# Altium project Mercury_AD_BaseBoard.PrjPcb (part 1 of 4)
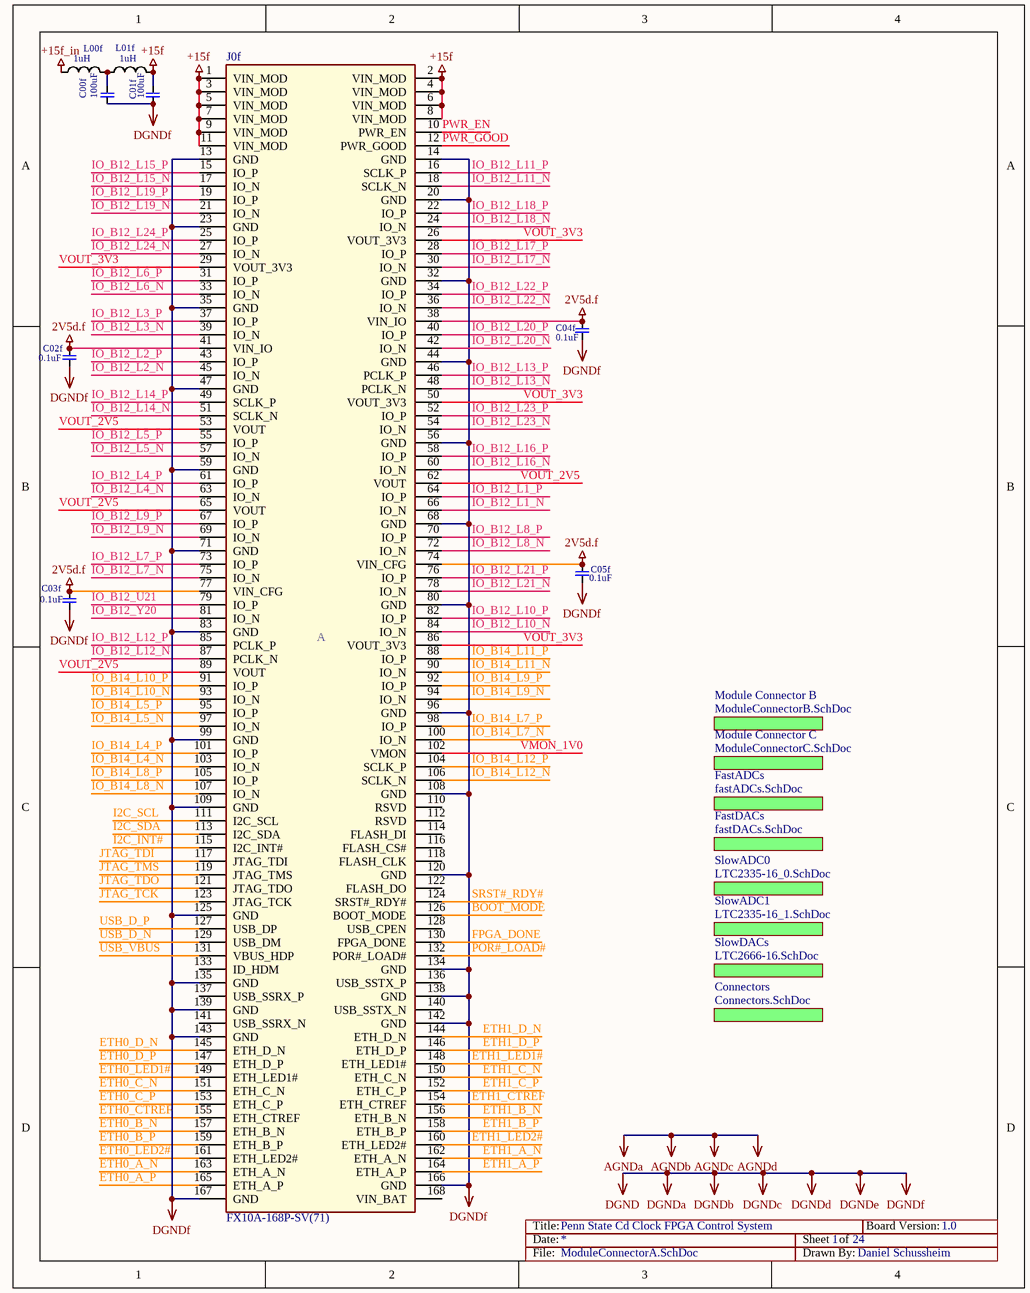
[diagram p0: ModuleConnectorA.SchDoc]
Designer: Daniel Schussheim; DrawnBy: Daniel Schussheim; PrjName: Penn State Cd Clock FPGA Control System; RevNum: 1.0
24 sheets, 1724 parts. Net scope: global (net labels, ports and power ports of the same name join across sheets).
Board file: Mercury_AD_BaseBoard_PCB.PcbDoc
Sheets:
  ModuleConnectorA.SchDoc
    FastDACs = fastDACs.SchDoc
      U_MAX5875_0 = MAX5875_0.SchDoc
      U_MAX5875_1 = MAX5875_1.SchDoc
      U_MAX5875_2 = MAX5875_2.SchDoc
      U_MAX5875_3 = MAX5875_3.SchDoc
      U_MAX5875_4 = MAX5875_4.SchDoc
      U_MAX5875_5 = MAX5875_5.SchDoc
      U_MAX5875_6 = MAX5875_6.SchDoc
    SlowDACs = LTC2666-16.SchDoc
      sDAC0 filters = sDAC_filters_0.SchDoc
      sDAC1 filters = sDAC_filters_1.SchDoc
    SlowADC0 = LTC2335-16_0.SchDoc
    SlowADC1 = LTC2335-16_1.SchDoc
    Connectors = Connectors.SchDoc
      Serial IO = SerialLineShiftRegs.SchDoc
    Module Connector C = ModuleConnectorC.SchDoc
    FastADCs = fastADCs.SchDoc
      FastADC0 = LTC2194_0.SchDoc
      FastADC1 = LTC2194_1.SchDoc
      FastADC2 = LTC2194_2.SchDoc
      FastADC3 = LTC2194_3.SchDoc
      FastADC4 = LTC2194_4.SchDoc
    Module Connector B = ModuleConnectorB.SchDoc

## Sheet ModuleConnectorA.SchDoc
size A portrait; DocumentNumber: 1; SheetNumber: 1; SheetTotal: 24

### Parts
C00f  100uF  [1206]
C01f  100uF  [1206]
C02f  0.1uF  [0603]
C03f  0.1uF  [0603]
C04f  0.1uF  [0603]
C05f  0.1uF  [0603]
J0f  FX10A-168P-SV(71)  [Mercury_Baseboard_Connector]
L00f  1uH  [1206]
L01f  1uH  [1206]

### Sub-sheets
Connectors = Connectors.SchDoc: no entries
FastADCs = fastADCs.SchDoc: no entries
FastDACs = fastDACs.SchDoc: no entries
Module Connector B = ModuleConnectorB.SchDoc: no entries
Module Connector C = ModuleConnectorC.SchDoc: no entries
SlowADC0 = LTC2335-16_0.SchDoc: no entries
SlowADC1 = LTC2335-16_1.SchDoc: no entries
SlowDACs = LTC2666-16.SchDoc: no entries

### Nets
2V5d.f: C02f.1 C03f.1 C04f.1 C05f.1 J0f.38(VIN_IO) J0f.41(VIN_IO) J0f.74(VIN_CFG) J0f.77(VIN_CFG)
+15f: C01f.1 J0f.1(VIN_MOD) J0f.2(VIN_MOD) J0f.3(VIN_MOD) J0f.4(VIN_MOD) J0f.5(VIN_MOD) J0f.6(VIN_MOD) J0f.7(VIN_MOD) J0f.8(VIN_MOD) J0f.9(VIN_MOD) J0f.11(VIN_MOD) L01f.2
+15f_in: L00f.1
AGNDa: C00f.2 C01f.2 C02f.2 C03f.2 C04f.2 C05f.2 J0f.13(GND) J0f.14(GND) J0f.20(GND) J0f.23(GND) J0f.32(GND) J0f.35(GND) J0f.44(GND) J0f.47(GND) J0f.56(GND) J0f.59(GND) J0f.68(GND) J0f.71(GND) J0f.80(GND) J0f.83(GND) J0f.96(GND) J0f.99(GND) J0f.108(GND) J0f.109(GND) J0f.120(GND) J0f.125(GND) J0f.134(GND) J0f.135(GND) J0f.138(GND) J0f.139(GND) J0f.142(GND) J0f.143(GND) J0f.166(GND) J0f.167(GND)  [also labelled AGNDb, AGNDc, AGNDd, DGND, DGNDa, DGNDb, DGNDc, DGNDd, DGNDe, DGNDf]
BOOT_MODE: J0f.126(BOOT_MODE)
ETH0_A_N: J0f.163(ETH_A_N)
ETH0_A_P: J0f.165(ETH_A_P)
ETH0_B_N: J0f.157(ETH_B_N)
ETH0_B_P: J0f.159(ETH_B_P)
ETH0_C_N: J0f.151(ETH_C_N)
ETH0_C_P: J0f.153(ETH_C_P)
ETH0_CTREF: J0f.155(ETH_CTREF)
ETH0_D_N: J0f.145(ETH_D_N)
ETH0_D_P: J0f.147(ETH_D_P)
ETH0_LED1#: J0f.149(ETH_LED1#)
ETH0_LED2#: J0f.161(ETH_LED2#)
ETH1_A_N: J0f.162(ETH_A_N)
ETH1_A_P: J0f.164(ETH_A_P)
ETH1_B_N: J0f.156(ETH_B_N)
ETH1_B_P: J0f.158(ETH_B_P)
ETH1_C_N: J0f.150(ETH_C_N)
ETH1_C_P: J0f.152(ETH_C_P)
ETH1_CTREF: J0f.154(ETH_CTREF)
ETH1_D_N: J0f.144(ETH_D_N)
ETH1_D_P: J0f.146(ETH_D_P)
ETH1_LED1#: J0f.148(ETH_LED1#)
ETH1_LED2#: J0f.160(ETH_LED2#)
FPGA_DONE: J0f.130(FPGA_DONE)
I2C_INT#: J0f.115(I2C_INT#)
I2C_SCL: J0f.111(I2C_SCL)
I2C_SDA: J0f.113(I2C_SDA)
IO_B12_L1_N: J0f.66(IO_N)
IO_B12_L1_P: J0f.64(IO_P)
IO_B12_L2_N: J0f.45(IO_N)
IO_B12_L2_P: J0f.43(IO_P)
IO_B12_L3_N: J0f.39(IO_N)
IO_B12_L3_P: J0f.37(IO_P)
IO_B12_L4_N: J0f.63(IO_N)
IO_B12_L4_P: J0f.61(IO_P)
IO_B12_L5_N: J0f.57(IO_N)
IO_B12_L5_P: J0f.55(IO_P)
IO_B12_L6_N: J0f.33(IO_N)
IO_B12_L6_P: J0f.31(IO_P)
IO_B12_L7_N: J0f.75(IO_N)
IO_B12_L7_P: J0f.73(IO_P)
IO_B12_L8_N: J0f.72(IO_N)
IO_B12_L8_P: J0f.70(IO_P)
IO_B12_L9_N: J0f.69(IO_N)
IO_B12_L9_P: J0f.67(IO_P)
IO_B12_L10_N: J0f.84(IO_N)
IO_B12_L10_P: J0f.82(IO_P)
IO_B12_L11_N: J0f.18(SCLK_N)
IO_B12_L11_P: J0f.16(SCLK_P)
IO_B12_L12_N: J0f.87(PCLK_N)
IO_B12_L12_P: J0f.85(PCLK_P)
IO_B12_L13_N: J0f.48(PCLK_N)
IO_B12_L13_P: J0f.46(PCLK_P)
IO_B12_L14_N: J0f.51(SCLK_N)
IO_B12_L14_P: J0f.49(SCLK_P)
IO_B12_L15_N: J0f.17(IO_N)
IO_B12_L15_P: J0f.15(IO_P)
IO_B12_L16_N: J0f.60(IO_N)
IO_B12_L16_P: J0f.58(IO_P)
IO_B12_L17_N: J0f.30(IO_N)
IO_B12_L17_P: J0f.28(IO_P)
IO_B12_L18_N: J0f.24(IO_N)
IO_B12_L18_P: J0f.22(IO_P)
IO_B12_L19_N: J0f.21(IO_N)
IO_B12_L19_P: J0f.19(IO_P)
IO_B12_L20_N: J0f.42(IO_N)
IO_B12_L20_P: J0f.40(IO_P)
IO_B12_L21_N: J0f.78(IO_N)
IO_B12_L21_P: J0f.76(IO_P)
IO_B12_L22_N: J0f.36(IO_N)
IO_B12_L22_P: J0f.34(IO_P)
IO_B12_L23_N: J0f.54(IO_N)
IO_B12_L23_P: J0f.52(IO_P)
IO_B12_L24_N: J0f.27(IO_N)
IO_B12_L24_P: J0f.25(IO_P)
IO_B12_U21: J0f.79(IO_P)
IO_B12_Y20: J0f.81(IO_N)
IO_B14_L4_N: J0f.103(IO_N)
IO_B14_L4_P: J0f.101(IO_P)
IO_B14_L5_N: J0f.97(IO_N)
IO_B14_L5_P: J0f.95(IO_P)
IO_B14_L7_N: J0f.100(IO_N)
IO_B14_L7_P: J0f.98(IO_P)
IO_B14_L8_N: J0f.107(IO_N)
IO_B14_L8_P: J0f.105(IO_P)
IO_B14_L9_N: J0f.94(IO_N)
IO_B14_L9_P: J0f.92(IO_P)
IO_B14_L10_N: J0f.93(IO_N)
IO_B14_L10_P: J0f.91(IO_P)
IO_B14_L11_N: J0f.90(IO_N)
IO_B14_L11_P: J0f.88(IO_P)
IO_B14_L12_N: J0f.106(SCLK_N)
IO_B14_L12_P: J0f.104(SCLK_P)
JTAG_TCK: J0f.123(JTAG_TCK)
JTAG_TDI: J0f.117(JTAG_TDI)
JTAG_TDO: J0f.121(JTAG_TDO)
JTAG_TMS: J0f.119(JTAG_TMS)
POR#_LOAD#: J0f.132(POR#_LOAD#)
PWR_EN: J0f.10(PWR_EN)
PWR_GOOD: J0f.12(PWR_GOOD)
SRST#_RDY#: J0f.124(SRST#_RDY#)
USB_D_N: J0f.129(USB_DM)
USB_D_P: J0f.127(USB_DP)
USB_VBUS: J0f.131(VBUS_HDP)
VMON_1V0: J0f.102(VMON)
VOUT_2V5: J0f.53(VOUT) J0f.62(VOUT) J0f.65(VOUT) J0f.89(VOUT)
VOUT_3V3: J0f.26(VOUT_3V3) J0f.29(VOUT_3V3) J0f.50(VOUT_3V3) J0f.86(VOUT_3V3)
NetC00f_1: C00f.1 L00f.2 L01f.1

Not connected (* = marked no-connect by the designer): J0f 110(RSVD) 112(RSVD) 114(FLASH_DI) 116(FLASH_CS#) 118(FLASH_CLK) 122(FLASH_DO) 128(USB_CPEN) 133(ID_HDM) 136(USB_SSTX_P) 137(USB_SSRX_P) 140(USB_SSTX_N) 141(USB_SSRX_N) 168(VIN_BAT)

### Notes on the sheet
- Title:
- Date:
- Sheet
- of
- Board Version:
- File:
- Drawn By:
- (in symbol Mercury_Baseboard_Connector-A) A

### Library data of the parts
C00f C01f C02f C03f C04f C05f = CAP
J0f = Mercury_Baseboard_Connector-A: Mercury Baseboard Connector; Manufacturer: Hirose; DistPartNumber: FX10A-168P-SV(71)-ND; Board_Variant: ALL; Check Sch: CG_2015-03-03; Enclustra PN: EN100374; Geometry.Height: 4mm stack height; Distributor: Digikey; Package: SMD - 168pin Hirose; ROHS: Yes; Supplier: Enclustra; Characteristics: -; Check PCB: -; Cost: 4.50; ManufPartNumber: FX10A-168P-SV(71); Temperature: -55..+85°C; Type: Connector; Value: FX10A-168P-SV(71)
L00f L01f = INDUCTOR

## Sheet fastDACs.SchDoc
size A; SheetNumber: 12; SheetTotal: 24
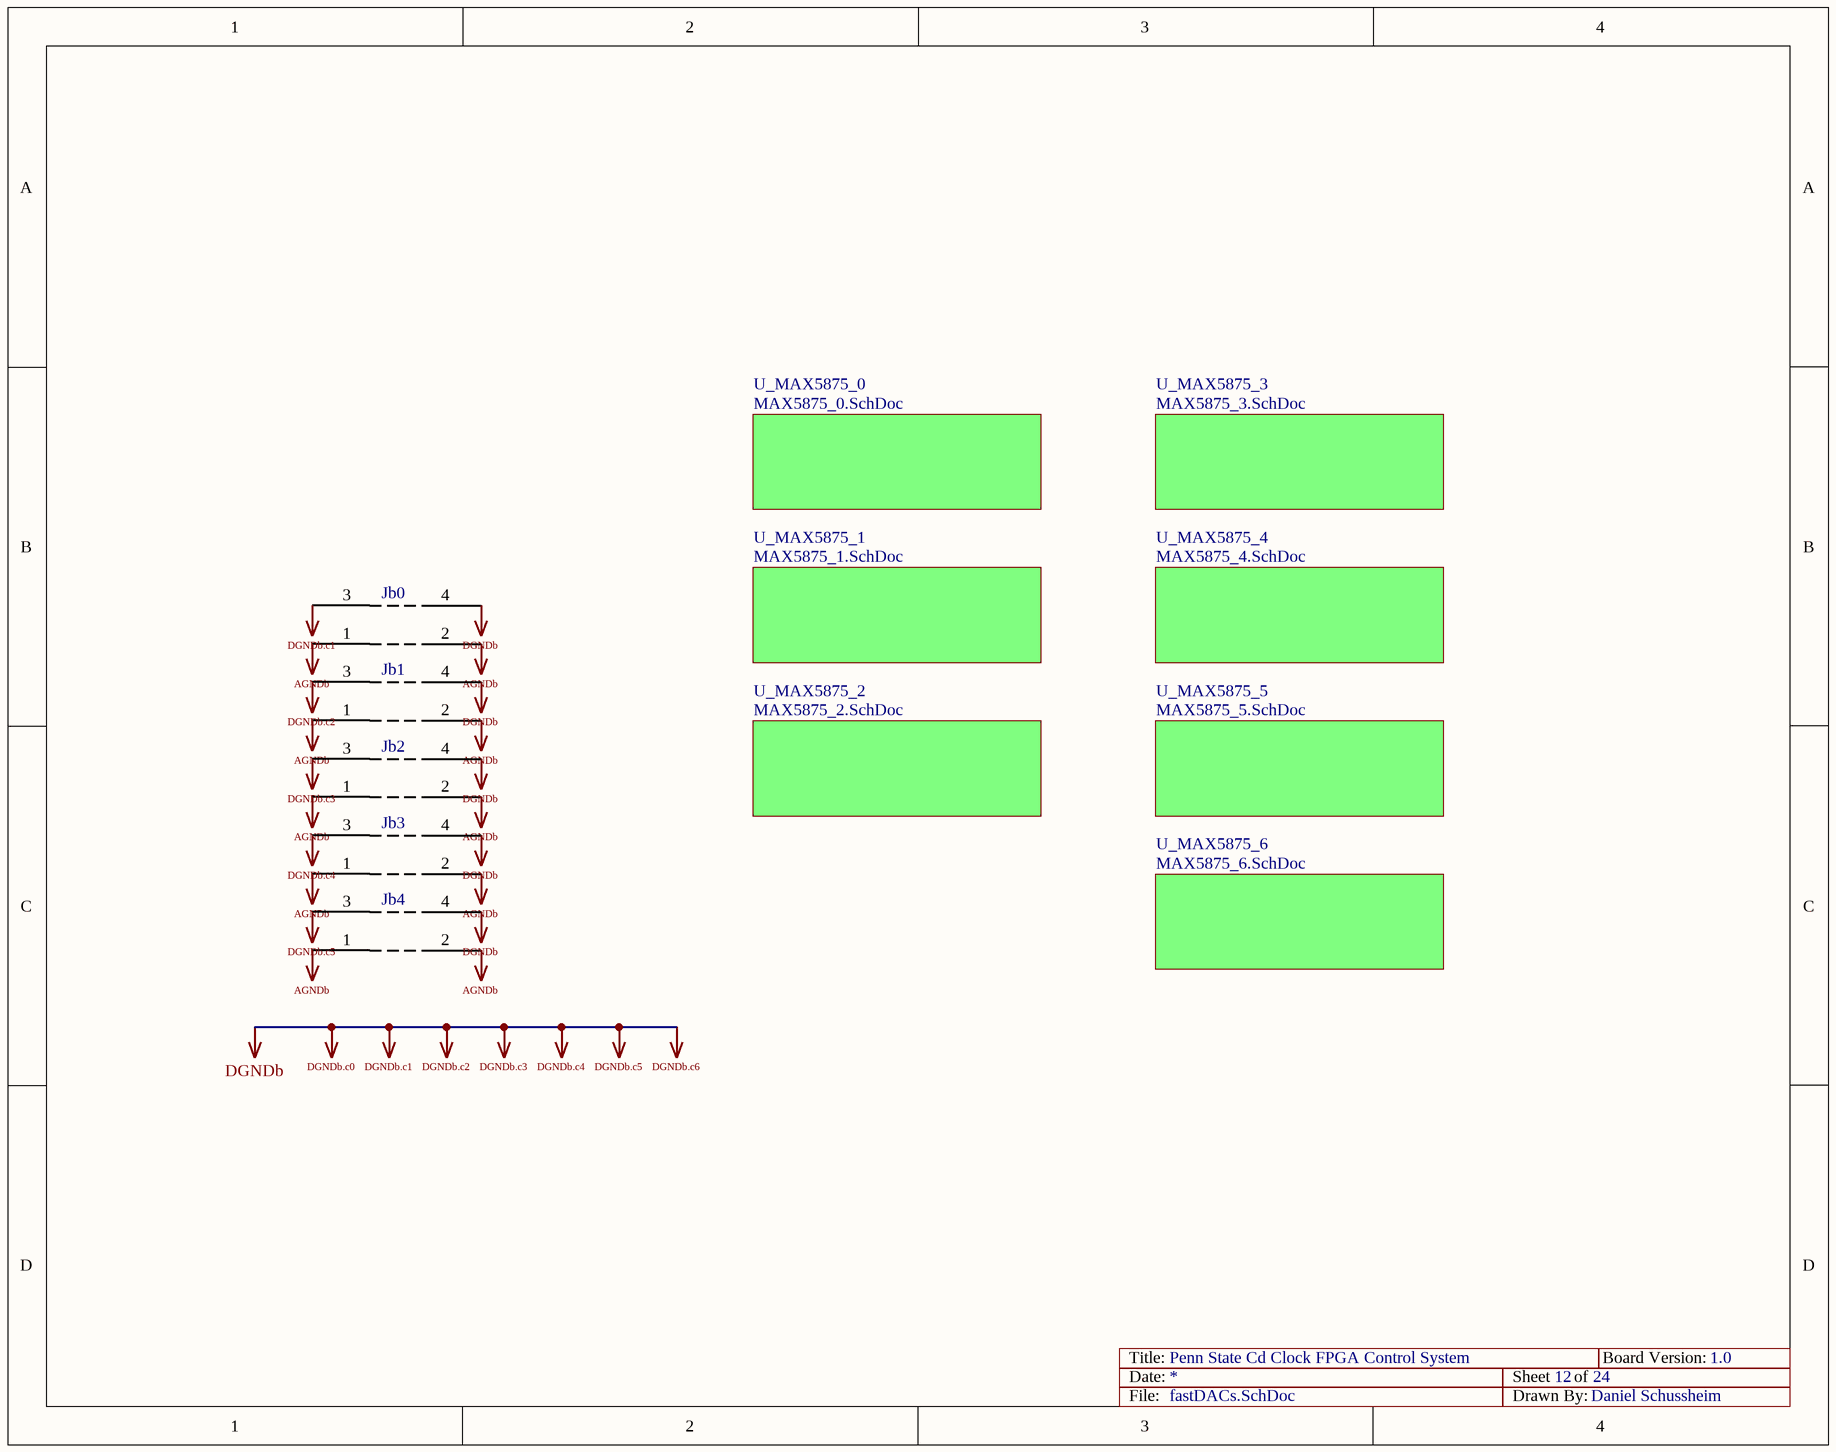
[diagram p1: fastDACs.SchDoc]

### Parts
Jb0  fDAC GND pads  [fDAC_GND_conn]  (value not drawn)
Jb1  fDAC GND pads  [fDAC_GND_conn]  (value not drawn)
Jb2  fDAC GND pads  [fDAC_GND_conn]  (value not drawn)
Jb3  fDAC GND pads  [fDAC_GND_conn]  (value not drawn)
Jb4  fDAC GND pads  [fDAC_GND_conn]  (value not drawn)

### Sub-sheets
U_MAX5875_0 = MAX5875_0.SchDoc: no entries
U_MAX5875_1 = MAX5875_1.SchDoc: no entries
U_MAX5875_2 = MAX5875_2.SchDoc: no entries
U_MAX5875_3 = MAX5875_3.SchDoc: no entries
U_MAX5875_4 = MAX5875_4.SchDoc: no entries
U_MAX5875_5 = MAX5875_5.SchDoc: no entries
U_MAX5875_6 = MAX5875_6.SchDoc: no entries

### Nets
AGNDb: Jb0.1 Jb0.2 Jb0.3 Jb0.4 Jb1.1 Jb1.2 Jb1.3 Jb1.4 Jb2.1 Jb2.2 Jb2.3 Jb2.4 Jb3.1 Jb3.2 Jb3.3 Jb3.4 Jb4.1 Jb4.2 Jb4.3 Jb4.4  [also labelled DGNDb, DGNDb.c0, DGNDb.c1, DGNDb.c2, DGNDb.c3, DGNDb.c4, DGNDb.c5, DGNDb.c6]  [project net AGNDa]

### Notes on the sheet
- Title:
- Date:
- Sheet
- of
- Board Version:
- File:
- Drawn By:

### Library data of the parts
Jb0-Jb4 = fADC GND pads

## Sheet MAX5875_0.SchDoc
size A; DocumentNumber: 3; SheetNumber: 13; SheetTotal: 24
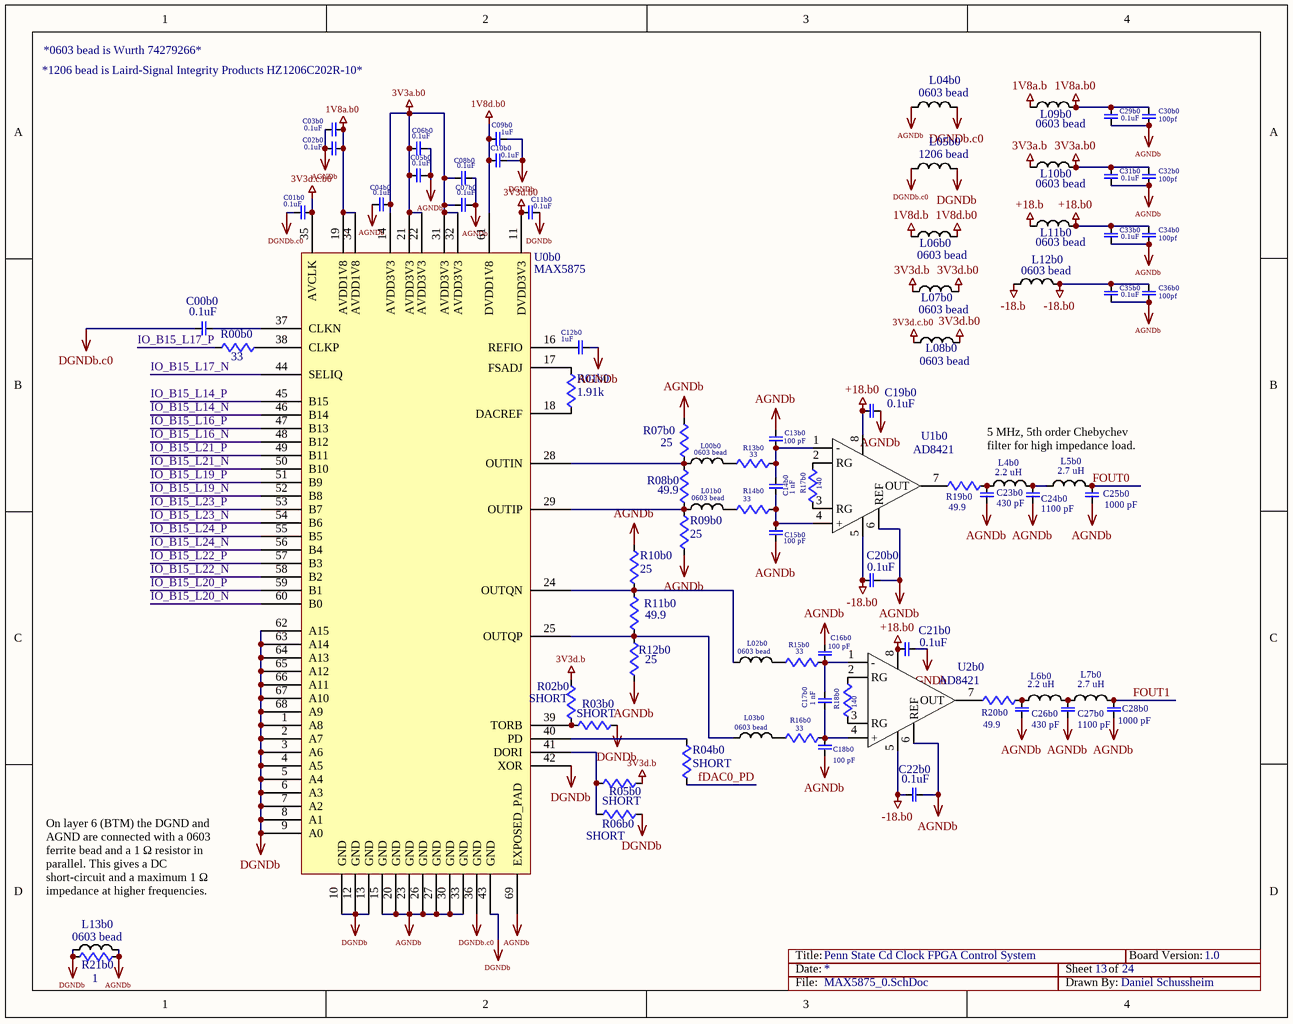
[diagram p2: MAX5875_0.SchDoc]

### Parts
C00b0  0.1uF  [0402]
C01b0  0.1uF  [0402]
C02b0  0.1uF  [0402]
C03b0  0.1uF  [0402]
C04b0  0.1uF  [0402]
C05b0  0.1uF  [0402]
C06b0  0.1uF  [0402]
C07b0  0.1uF  [0402]
C08b0  0.1uF  [0402]
C09b0  1uF  [0603]
C10b0  0.1uF  [0402]
C11b0  0.1uF  [0402]
C12b0  1uF  [0402]
C13b0  100 pF  [0603]
C14b0  1 nF  [0603]
C15b0  100 pF  [0603]
C16b0  100 pF  [0603]
C17b0  1 nF  [0603]
C18b0  100 pF  [0603]
C19b0  0.1uF  [0603]
C20b0  0.1uF  [0603]
C21b0  0.1uF  [0603]
C22b0  0.1uF  [0603]
C23b0  430 pF  [0603]
C24b0  1100 pF  [0603]
C25b0  1000 pF  [0603]
C26b0  430 pF  [0603]
C27b0  1100 pF  [0603]
C28b0  1000 pF  [0603]
C29b0  0.1uF  [0603]
C30b0  100pf  [0603]
C31b0  0.1uF  [0603]
C32b0  100pf  [0603]
C33b0  0.1uF  [0603]
C34b0  100pf  [0603]
C35b0  0.1uF  [0603]
C36b0  100pf  [0603]
L00b0  0603 bead  [0603]
L01b0  0603 bead  [0603]
L02b0  0603 bead  [0603]
L03b0  0603 bead  [0603]
L04b0  0603 bead  [0603]
L4b0  2.2 uH  [0603]
L5b0  2.7 uH  [0603]
L05b0  1206 bead  [1206]
L06b0  0603 bead  [0603]
L6b0  2.2 uH  [0603]
L7b0  2.7 uH  [0603]
L07b0  0603 bead  [0603]
L08b0  0603 bead  [0603]
L09b0  0603 bead  [0603]
L10b0  0603 bead  [0603]
L11b0  0603 bead  [0603]
L12b0  0603 bead  [0603]
L13b0  0603 bead  [0603]
R00b0  33  [0402]
R01b0  1.91k  [0603]
R02b0  SHORT  [0603]
R03b0  SHORT  [0603]
R04b0  SHORT  [0603]
R05b0  SHORT  [0603]
R06b0  SHORT  [0603]
R07b0  25  [0603]
R08b0  49.9  [0603]
R09b0  25  [0603]
R10b0  25  [0603]
R11b0  49.9  [0603]
R12b0  25  [0603]
R13b0  33  [0603]
R14b0  33  [0603]
R15b0  33  [0603]
R16b0  33  [0603]
R17b0  140  [0402]
R18b0  140  [0402]
R19b0  49.9  [0603]
R20b0  49.9  [0603]
R21b0  1  [0603]
U0b0  MAX5875  [68LQFN]
U1b0  AD8421  [8SOIC]
U2b0  AD8421  [8SOIC]

### Nets
1V8a.b: L09b0.1
1V8a.b0: C02b0.1 C03b0.2 C29b0.1 C30b0.1 L09b0.2 U0b0.19(AVDD1V8) U0b0.34(AVDD1V8)
1V8d.b: L06b0.1
1V8d.b0: C09b0.2 C10b0.2 L06b0.2 U0b0.61(DVDD1V8)
3V3a.b: L10b0.1
3V3a.b0: C04b0.1 C05b0.2 C06b0.1 C07b0.2 C08b0.1 C31b0.1 C32b0.1 L10b0.2 U0b0.14(AVDD3V3) U0b0.21(AVDD3V3) U0b0.22(AVDD3V3) U0b0.31(AVDD3V3) U0b0.32(AVDD3V3)
3V3d.b: L07b0.1 R02b0.2 R05b0.2
3V3d.b0: C11b0.2 L07b0.2 L08b0.2 U0b0.11(DVDD3V3)
3V3d.c.b0: C01b0.1 L08b0.1 U0b0.35(AVCLK)
+18.b: L11b0.1
+18.b0: C19b0.2 C21b0.2 C33b0.1 C34b0.1 L11b0.2 U1b0.8(+VS) U2b0.8(+VS)
-18.b: L12b0.1
-18.b0: C20b0.2 C22b0.2 C35b0.1 C36b0.1 L12b0.2 U1b0.5(-VS) U2b0.5(-VS)
AGNDb: C00b0.2 C01b0.2 C02b0.2 C03b0.1 C04b0.2 C05b0.1 C06b0.2 C07b0.1 C08b0.2 C09b0.1 C10b0.1 C11b0.1 C12b0.1 C13b0.1 C15b0.1 C16b0.1 C18b0.1 C19b0.1 C20b0.1 C21b0.1 C22b0.1 C23b0.2 C24b0.2 C25b0.2 C26b0.2 C27b0.2 C28b0.2 C29b0.2 C30b0.2 C31b0.2 C32b0.2 C33b0.2 C34b0.2 C35b0.2 C36b0.2 L04b0.1 L04b0.2 L05b0.1 L05b0.2 L13b0.1 L13b0.2 R03b0.2 R06b0.2 R07b0.2 R09b0.1 R10b0.2 R12b0.1 R21b0.1 R21b0.2 U0b0.1(A8) U0b0.2(A7) U0b0.3(A6) U0b0.4(A5) U0b0.5(A4) U0b0.6(A3) U0b0.7(A2) U0b0.8(A1) U0b0.9(A0) U0b0.10(GND) U0b0.12(GND) U0b0.13(GND) U0b0.15(GND) U0b0.20(GND) U0b0.23(GND) U0b0.26(GND) U0b0.27(GND) U0b0.30(GND) U0b0.33(GND) U0b0.36(GND) U0b0.42(XOR) U0b0.43(GND) U0b0.62(A15) U0b0.63(A14) U0b0.64(A13) U0b0.65(A12) U0b0.66(A11) U0b0.67(A10) U0b0.68(A9) U0b0.69(EXPOSED_PAD) U1b0.6(REF) U2b0.6(REF)  [also labelled DGNDb, DGNDb.c0]  [project net AGNDa]
fDAC0_PD: R04b0.2
FOUT0: C25b0.1 L5b0.2
FOUT1: C28b0.1 L7b0.2
IO_B15_L14_N: U0b0.46(B14)
IO_B15_L14_P: U0b0.45(B15)
IO_B15_L16_N: U0b0.48(B12)
IO_B15_L16_P: U0b0.47(B13)
IO_B15_L17_N: U0b0.44(SELIQ)
IO_B15_L17_P: R00b0.2
IO_B15_L19_N: U0b0.52(B8)
IO_B15_L19_P: U0b0.51(B9)
IO_B15_L20_N: U0b0.60(B0)
IO_B15_L20_P: U0b0.59(B1)
IO_B15_L21_N: U0b0.50(B10)
IO_B15_L21_P: U0b0.49(B11)
IO_B15_L22_N: U0b0.58(B2)
IO_B15_L22_P: U0b0.57(B3)
IO_B15_L23_N: U0b0.54(B6)
IO_B15_L23_P: U0b0.53(B7)
IO_B15_L24_N: U0b0.56(B4)
IO_B15_L24_P: U0b0.55(B5)
NetC00b0_1: C00b0.1 U0b0.37(CLKN)
NetC12b0_2: C12b0.2 U0b0.16(REFIO)
NetC13b0_2: C13b0.2 C14b0.1 R13b0.1 U1b0.1(-)
NetC14b0_2: C14b0.2 C15b0.2 R14b0.1 U1b0.4(+)
NetC16b0_2: C16b0.2 C17b0.1 R15b0.1 U2b0.1(-)
NetC17b0_2: C17b0.2 C18b0.2 R16b0.1 U2b0.4(+)
NetC23b0_1: C23b0.1 L4b0.1 R19b0.2
NetC24b0_1: C24b0.1 L4b0.2 L5b0.1
NetC26b0_1: C26b0.1 L6b0.1 R20b0.2
NetC27b0_1: C27b0.1 L6b0.2 L7b0.1
NetL00b0_1: L00b0.1 R07b0.1 R08b0.2 U0b0.28(OUTIN)
NetL00b0_2: L00b0.2 R13b0.2
NetL01b0_1: L01b0.1 R08b0.1 R09b0.2 U0b0.29(OUTIP)
NetL01b0_2: L01b0.2 R14b0.2
NetL02b0_1: L02b0.1 R10b0.1 R11b0.2 U0b0.24(OUTQN)
NetL02b0_2: L02b0.2 R15b0.2
NetL03b0_1: L03b0.1 R11b0.1 R12b0.2 U0b0.25(OUTQP)
NetL03b0_2: L03b0.2 R16b0.2
NetR00b0_1: R00b0.1 U0b0.38(CLKP)
NetR01b0_1: R01b0.1 U0b0.18(DACREF)
NetR01b0_2: R01b0.2 U0b0.17(FSADJ)
NetR02b0_1: R02b0.1 R03b0.1 U0b0.39(TORB)
NetR04b0_1: R04b0.1 U0b0.40(PD)
NetR05b0_1: R05b0.1 R06b0.1 U0b0.41(DORI)
NetR17b0_1: R17b0.1 U1b0.3(RG)
NetR17b0_2: R17b0.2 U1b0.2(RG)
NetR18b0_1: R18b0.1 U2b0.3(RG)
NetR18b0_2: R18b0.2 U2b0.2(RG)
NetR19b0_1: R19b0.1 U1b0.7(OUT)
NetR20b0_1: R20b0.1 U2b0.7(OUT)

### Notes on the sheet
- *1206 bead is Laird-Signal Integrity Products HZ1206C202R-10*
- *0603 bead is Wurth 74279266*
- 5 MHz, 5th order Chebychev filter for high impedance load.
- On layer 6 (BTM) the DGND and AGND are connected with a 0603 ferrite bead and a 1 Ω resistor in parallel. This gives a DC short-circuit and a maximum 1 Ω impedance at higher frequencies.
- Title:
- Date:
- Sheet
- of
- Board Version:
- File:
- Drawn By:

### Library data of the parts
C00b0 C01b0 C02b0 C03b0 C04b0 C05b0 C06b0 C07b0 C08b0 C09b0 C10b0 C11b0 C12b0 C13b0 C14b0 C15b0 C16b0 C17b0 C18b0 C19b0 C20b0 C21b0 C22b0 C23b0 C24b0 C25b0 C26b0 C27b0 C28b0 C29b0 C30b0 C31b0 C32b0 C33b0 C34b0 C35b0 C36b0 = CAP
L00b0 L01b0 L02b0 L03b0 L04b0 L4b0 L5b0 L05b0 L06b0 L6b0 L7b0 L07b0 L08b0 L09b0 L10b0 L11b0 L12b0 L13b0 = INDUCTOR
R00b0 R01b0 R02b0 R03b0 R04b0 R05b0 R06b0 R07b0 R08b0 R09b0 R10b0 R11b0 R12b0 R13b0 R14b0 R15b0 R16b0 R17b0 R18b0 R19b0 R20b0 R21b0 = RES

## Sheet MAX5875_1.SchDoc
size A; SheetNumber: 14; SheetTotal: 24
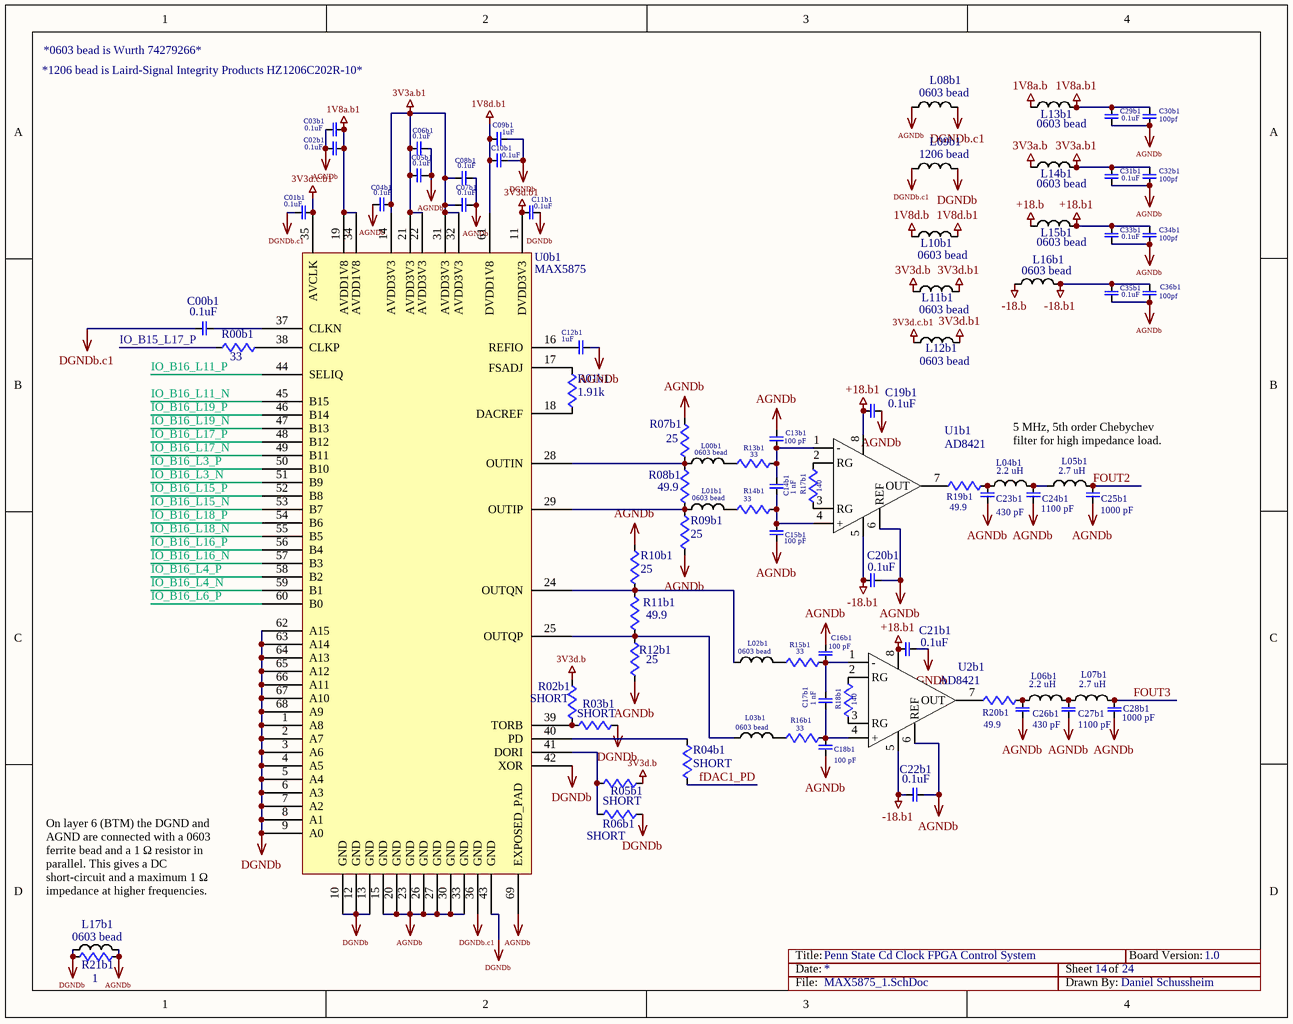
[diagram p3: MAX5875_1.SchDoc]

### Parts
C00b1  0.1uF  [0402]
C01b1  0.1uF  [0402]
C02b1  0.1uF  [0402]
C03b1  0.1uF  [0402]
C04b1  0.1uF  [0402]
C05b1  0.1uF  [0402]
C06b1  0.1uF  [0402]
C07b1  0.1uF  [0402]
C08b1  0.1uF  [0402]
C09b1  1uF  [0603]
C10b1  0.1uF  [0402]
C11b1  0.1uF  [0402]
C12b1  1uF  [0402]
C13b1  100 pF  [0603]
C14b1  1 nF  [0603]
C15b1  100 pF  [0603]
C16b1  100 pF  [0603]
C17b1  1 nF  [0603]
C18b1  100 pF  [0603]
C19b1  0.1uF  [0603]
C20b1  0.1uF  [0603]
C21b1  0.1uF  [0603]
C22b1  0.1uF  [0603]
C23b1  430 pF  [0603]
C24b1  1100 pF  [0603]
C25b1  1000 pF  [0603]
C26b1  430 pF  [0603]
C27b1  1100 pF  [0603]
C28b1  1000 pF  [0603]
C29b1  0.1uF  [0603]
C30b1  100pf  [0603]
C31b1  0.1uF  [0603]
C32b1  100pf  [0603]
C33b1  0.1uF  [0603]
C34b1  100pf  [0603]
C35b1  0.1uF  [0603]
C36b1  100pf  [0603]
L00b1  0603 bead  [0603]
L01b1  0603 bead  [0603]
L02b1  0603 bead  [0603]
L03b1  0603 bead  [0603]
L04b1  2.2 uH  [0603]
L05b1  2.7 uH  [0603]
L06b1  2.2 uH  [0603]
L07b1  2.7 uH  [0603]
L08b1  0603 bead  [0603]
L09b1  1206 bead  [1206]
L10b1  0603 bead  [0603]
L11b1  0603 bead  [0603]
L12b1  0603 bead  [0603]
L13b1  0603 bead  [0603]
L14b1  0603 bead  [0603]
L15b1  0603 bead  [0603]
L16b1  0603 bead  [0603]
L17b1  0603 bead  [0603]
R00b1  33  [0402]
R01b1  1.91k  [0603]
R02b1  SHORT  [0603]
R03b1  SHORT  [0603]
R04b1  SHORT  [0603]
R05b1  SHORT  [0603]
R06b1  SHORT  [0603]
R07b1  25  [0603]
R08b1  49.9  [0603]
R09b1  25  [0603]
R10b1  25  [0603]
R11b1  49.9  [0603]
R12b1  25  [0603]
R13b1  33  [0603]
R14b1  33  [0603]
R15b1  33  [0603]
R16b1  33  [0603]
R17b1  140  [0402]
R18b1  140  [0402]
R19b1  49.9  [0603]
R20b1  49.9  [0603]
R21b1  1  [0603]
U0b1  MAX5875  [68LQFN]
U1b1  AD8421  [8SOIC]
U2b1  AD8421  [8SOIC]

### Nets
1V8a.b: L13b1.1
1V8a.b1: C02b1.1 C03b1.2 C29b1.1 C30b1.1 L13b1.2 U0b1.19(AVDD1V8) U0b1.34(AVDD1V8)
1V8d.b: L10b1.1
1V8d.b1: C09b1.2 C10b1.2 L10b1.2 U0b1.61(DVDD1V8)
3V3a.b: L14b1.1
3V3a.b1: C04b1.1 C05b1.2 C06b1.1 C07b1.2 C08b1.1 C31b1.1 C32b1.1 L14b1.2 U0b1.14(AVDD3V3) U0b1.21(AVDD3V3) U0b1.22(AVDD3V3) U0b1.31(AVDD3V3) U0b1.32(AVDD3V3)
3V3d.b: L11b1.1 R02b1.2 R05b1.2
3V3d.b1: C11b1.2 L11b1.2 L12b1.2 U0b1.11(DVDD3V3)
3V3d.c.b1: C01b1.1 L12b1.1 U0b1.35(AVCLK)
+18.b: L15b1.1
+18.b1: C19b1.2 C21b1.2 C33b1.1 C34b1.1 L15b1.2 U1b1.8(+VS) U2b1.8(+VS)
-18.b: L16b1.1
-18.b1: C20b1.2 C22b1.2 C35b1.1 C36b1.1 L16b1.2 U1b1.5(-VS) U2b1.5(-VS)
AGNDb: C00b1.2 C01b1.2 C02b1.2 C03b1.1 C04b1.2 C05b1.1 C06b1.2 C07b1.1 C08b1.2 C09b1.1 C10b1.1 C11b1.1 C12b1.1 C13b1.1 C15b1.1 C16b1.1 C18b1.1 C19b1.1 C20b1.1 C21b1.1 C22b1.1 C23b1.2 C24b1.2 C25b1.2 C26b1.2 C27b1.2 C28b1.2 C29b1.2 C30b1.2 C31b1.2 C32b1.2 C33b1.2 C34b1.2 C35b1.2 C36b1.2 L08b1.1 L08b1.2 L09b1.1 L09b1.2 L17b1.1 L17b1.2 R03b1.2 R06b1.2 R07b1.2 R09b1.1 R10b1.2 R12b1.1 R21b1.1 R21b1.2 U0b1.1(A8) U0b1.2(A7) U0b1.3(A6) U0b1.4(A5) U0b1.5(A4) U0b1.6(A3) U0b1.7(A2) U0b1.8(A1) U0b1.9(A0) U0b1.10(GND) U0b1.12(GND) U0b1.13(GND) U0b1.15(GND) U0b1.20(GND) U0b1.23(GND) U0b1.26(GND) U0b1.27(GND) U0b1.30(GND) U0b1.33(GND) U0b1.36(GND) U0b1.42(XOR) U0b1.43(GND) U0b1.62(A15) U0b1.63(A14) U0b1.64(A13) U0b1.65(A12) U0b1.66(A11) U0b1.67(A10) U0b1.68(A9) U0b1.69(EXPOSED_PAD) U1b1.6(REF) U2b1.6(REF)  [also labelled DGNDb, DGNDb.c1]  [project net AGNDa]
fDAC1_PD: R04b1.2
FOUT2: C25b1.1 L05b1.2
FOUT3: C28b1.1 L07b1.2
IO_B15_L17_P: R00b1.2
IO_B16_L3_N: U0b1.51(B9)
IO_B16_L3_P: U0b1.50(B10)
IO_B16_L4_N: U0b1.59(B1)
IO_B16_L4_P: U0b1.58(B2)
IO_B16_L6_P: U0b1.60(B0)
IO_B16_L11_N: U0b1.45(B15)
IO_B16_L11_P: U0b1.44(SELIQ)
IO_B16_L15_N: U0b1.53(B7)
IO_B16_L15_P: U0b1.52(B8)
IO_B16_L16_N: U0b1.57(B3)
IO_B16_L16_P: U0b1.56(B4)
IO_B16_L17_N: U0b1.49(B11)
IO_B16_L17_P: U0b1.48(B12)
IO_B16_L18_N: U0b1.55(B5)
IO_B16_L18_P: U0b1.54(B6)
IO_B16_L19_N: U0b1.47(B13)
IO_B16_L19_P: U0b1.46(B14)
NetC00b1_1: C00b1.1 U0b1.37(CLKN)
NetC12b1_2: C12b1.2 U0b1.16(REFIO)
NetC13b1_2: C13b1.2 C14b1.1 R13b1.1 U1b1.1(-)
NetC14b1_2: C14b1.2 C15b1.2 R14b1.1 U1b1.4(+)
NetC16b1_2: C16b1.2 C17b1.1 R15b1.1 U2b1.1(-)
NetC17b1_2: C17b1.2 C18b1.2 R16b1.1 U2b1.4(+)
NetC23b1_1: C23b1.1 L04b1.1 R19b1.2
NetC24b1_1: C24b1.1 L04b1.2 L05b1.1
NetC26b1_1: C26b1.1 L06b1.1 R20b1.2
NetC27b1_1: C27b1.1 L06b1.2 L07b1.1
NetL00b1_1: L00b1.1 R07b1.1 R08b1.2 U0b1.28(OUTIN)
NetL00b1_2: L00b1.2 R13b1.2
NetL01b1_1: L01b1.1 R08b1.1 R09b1.2 U0b1.29(OUTIP)
NetL01b1_2: L01b1.2 R14b1.2
NetL02b1_1: L02b1.1 R10b1.1 R11b1.2 U0b1.24(OUTQN)
NetL02b1_2: L02b1.2 R15b1.2
NetL03b1_1: L03b1.1 R11b1.1 R12b1.2 U0b1.25(OUTQP)
NetL03b1_2: L03b1.2 R16b1.2
NetR00b1_1: R00b1.1 U0b1.38(CLKP)
NetR01b1_1: R01b1.1 U0b1.18(DACREF)
NetR01b1_2: R01b1.2 U0b1.17(FSADJ)
NetR02b1_1: R02b1.1 R03b1.1 U0b1.39(TORB)
NetR04b1_1: R04b1.1 U0b1.40(PD)
NetR05b1_1: R05b1.1 R06b1.1 U0b1.41(DORI)
NetR17b1_1: R17b1.1 U1b1.3(RG)
NetR17b1_2: R17b1.2 U1b1.2(RG)
NetR18b1_1: R18b1.1 U2b1.3(RG)
NetR18b1_2: R18b1.2 U2b1.2(RG)
NetR19b1_1: R19b1.1 U1b1.7(OUT)
NetR20b1_1: R20b1.1 U2b1.7(OUT)

### Notes on the sheet
- *1206 bead is Laird-Signal Integrity Products HZ1206C202R-10*
- *0603 bead is Wurth 74279266*
- 5 MHz, 5th order Chebychev filter for high impedance load.
- On layer 6 (BTM) the DGND and AGND are connected with a 0603 ferrite bead and a 1 Ω resistor in parallel. This gives a DC short-circuit and a maximum 1 Ω impedance at higher frequencies.
- Title:
- Date:
- Sheet
- of
- Board Version:
- File:
- Drawn By:

### Library data of the parts
C00b1 C01b1 C02b1 C03b1 C04b1 C05b1 C06b1 C07b1 C08b1 C09b1 C10b1 C11b1 C12b1 C13b1 C14b1 C15b1 C16b1 C17b1 C18b1 C19b1 C20b1 C21b1 C22b1 C23b1 C24b1 C25b1 C26b1 C27b1 C28b1 C29b1 C30b1 C31b1 C32b1 C33b1 C34b1 C35b1 C36b1 = CAP
L00b1 L01b1 L02b1 L03b1 L04b1 L05b1 L06b1 L07b1 L08b1 L09b1 L10b1 L11b1 L12b1 L13b1 L14b1 L15b1 L16b1 L17b1 = INDUCTOR
R00b1 R01b1 R02b1 R03b1 R04b1 R05b1 R06b1 R07b1 R08b1 R09b1 R10b1 R11b1 R12b1 R13b1 R14b1 R15b1 R16b1 R17b1 R18b1 R19b1 R20b1 R21b1 = RES

## Sheet MAX5875_2.SchDoc
size A; SheetNumber: 15; SheetTotal: 24
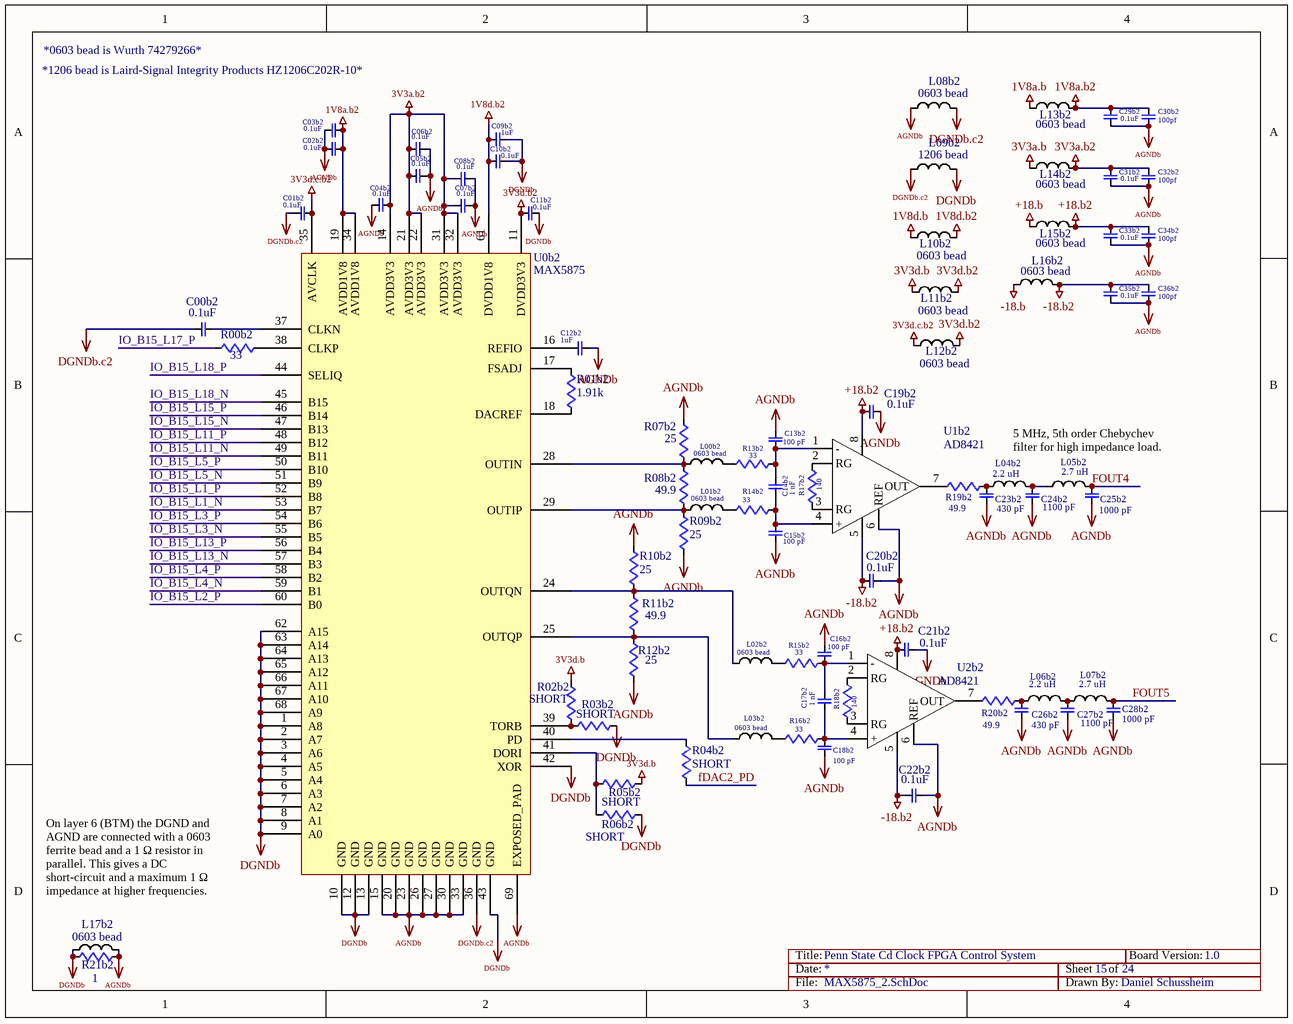
[diagram p4: MAX5875_2.SchDoc]

### Parts
C00b2  0.1uF  [0402]
C01b2  0.1uF  [0402]
C02b2  0.1uF  [0402]
C03b2  0.1uF  [0402]
C04b2  0.1uF  [0402]
C05b2  0.1uF  [0402]
C06b2  0.1uF  [0402]
C07b2  0.1uF  [0402]
C08b2  0.1uF  [0402]
C09b2  1uF  [0603]
C10b2  0.1uF  [0402]
C11b2  0.1uF  [0402]
C12b2  1uF  [0402]
C13b2  100 pF  [0603]
C14b2  1 nF  [0603]
C15b2  100 pF  [0603]
C16b2  100 pF  [0603]
C17b2  1 nF  [0603]
C18b2  100 pF  [0603]
C19b2  0.1uF  [0603]
C20b2  0.1uF  [0603]
C21b2  0.1uF  [0603]
C22b2  0.1uF  [0603]
C23b2  430 pF  [0603]
C24b2  1100 pF  [0603]
C25b2  1000 pF  [0603]
C26b2  430 pF  [0603]
C27b2  1100 pF  [0603]
C28b2  1000 pF  [0603]
C29b2  0.1uF  [0603]
C30b2  100pf  [0603]
C31b2  0.1uF  [0603]
C32b2  100pf  [0603]
C33b2  0.1uF  [0603]
C34b2  100pf  [0603]
C35b2  0.1uF  [0603]
C36b2  100pf  [0603]
L00b2  0603 bead  [0603]
L01b2  0603 bead  [0603]
L02b2  0603 bead  [0603]
L03b2  0603 bead  [0603]
L04b2  2.2 uH  [0603]
L05b2  2.7 uH  [0603]
L06b2  2.2 uH  [0603]
L07b2  2.7 uH  [0603]
L08b2  0603 bead  [0603]
L09b2  1206 bead  [1206]
L10b2  0603 bead  [0603]
L11b2  0603 bead  [0603]
L12b2  0603 bead  [0603]
L13b2  0603 bead  [0603]
L14b2  0603 bead  [0603]
L15b2  0603 bead  [0603]
L16b2  0603 bead  [0603]
L17b2  0603 bead  [0603]
R00b2  33  [0402]
R01b2  1.91k  [0603]
R02b2  SHORT  [0603]
R03b2  SHORT  [0603]
R04b2  SHORT  [0603]
R05b2  SHORT  [0603]
R06b2  SHORT  [0603]
R07b2  25  [0603]
R08b2  49.9  [0603]
R09b2  25  [0603]
R10b2  25  [0603]
R11b2  49.9  [0603]
R12b2  25  [0603]
R13b2  33  [0603]
R14b2  33  [0603]
R15b2  33  [0603]
R16b2  33  [0603]
R17b2  140  [0402]
R18b2  140  [0402]
R19b2  49.9  [0603]
R20b2  49.9  [0603]
R21b2  1  [0603]
U0b2  MAX5875  [68LQFN]
U1b2  AD8421  [8SOIC]
U2b2  AD8421  [8SOIC]

### Nets
1V8a.b: L13b2.1
1V8a.b2: C02b2.1 C03b2.2 C29b2.1 C30b2.1 L13b2.2 U0b2.19(AVDD1V8) U0b2.34(AVDD1V8)
1V8d.b: L10b2.1
1V8d.b2: C09b2.2 C10b2.2 L10b2.2 U0b2.61(DVDD1V8)
3V3a.b: L14b2.1
3V3a.b2: C04b2.1 C05b2.2 C06b2.1 C07b2.2 C08b2.1 C31b2.1 C32b2.1 L14b2.2 U0b2.14(AVDD3V3) U0b2.21(AVDD3V3) U0b2.22(AVDD3V3) U0b2.31(AVDD3V3) U0b2.32(AVDD3V3)
3V3d.b: L11b2.1 R02b2.2 R05b2.2
3V3d.b2: C11b2.2 L11b2.2 L12b2.2 U0b2.11(DVDD3V3)
3V3d.c.b2: C01b2.1 L12b2.1 U0b2.35(AVCLK)
+18.b: L15b2.1
+18.b2: C19b2.2 C21b2.2 C33b2.1 C34b2.1 L15b2.2 U1b2.8(+VS) U2b2.8(+VS)
-18.b: L16b2.1
-18.b2: C20b2.2 C22b2.2 C35b2.1 C36b2.1 L16b2.2 U1b2.5(-VS) U2b2.5(-VS)
AGNDb: C00b2.2 C01b2.2 C02b2.2 C03b2.1 C04b2.2 C05b2.1 C06b2.2 C07b2.1 C08b2.2 C09b2.1 C10b2.1 C11b2.1 C12b2.1 C13b2.1 C15b2.1 C16b2.1 C18b2.1 C19b2.1 C20b2.1 C21b2.1 C22b2.1 C23b2.2 C24b2.2 C25b2.2 C26b2.2 C27b2.2 C28b2.2 C29b2.2 C30b2.2 C31b2.2 C32b2.2 C33b2.2 C34b2.2 C35b2.2 C36b2.2 L08b2.1 L08b2.2 L09b2.1 L09b2.2 L17b2.1 L17b2.2 R03b2.2 R06b2.2 R07b2.2 R09b2.1 R10b2.2 R12b2.1 R21b2.1 R21b2.2 U0b2.1(A8) U0b2.2(A7) U0b2.3(A6) U0b2.4(A5) U0b2.5(A4) U0b2.6(A3) U0b2.7(A2) U0b2.8(A1) U0b2.9(A0) U0b2.10(GND) U0b2.12(GND) U0b2.13(GND) U0b2.15(GND) U0b2.20(GND) U0b2.23(GND) U0b2.26(GND) U0b2.27(GND) U0b2.30(GND) U0b2.33(GND) U0b2.36(GND) U0b2.42(XOR) U0b2.43(GND) U0b2.62(A15) U0b2.63(A14) U0b2.64(A13) U0b2.65(A12) U0b2.66(A11) U0b2.67(A10) U0b2.68(A9) U0b2.69(EXPOSED_PAD) U1b2.6(REF) U2b2.6(REF)  [also labelled DGNDb, DGNDb.c2]  [project net AGNDa]
fDAC2_PD: R04b2.2
FOUT4: C25b2.1 L05b2.2
FOUT5: C28b2.1 L07b2.2
IO_B15_L1_N: U0b2.53(B7)
IO_B15_L1_P: U0b2.52(B8)
IO_B15_L2_P: U0b2.60(B0)
IO_B15_L3_N: U0b2.55(B5)
IO_B15_L3_P: U0b2.54(B6)
IO_B15_L4_N: U0b2.59(B1)
IO_B15_L4_P: U0b2.58(B2)
IO_B15_L5_N: U0b2.51(B9)
IO_B15_L5_P: U0b2.50(B10)
IO_B15_L11_N: U0b2.49(B11)
IO_B15_L11_P: U0b2.48(B12)
IO_B15_L13_N: U0b2.57(B3)
IO_B15_L13_P: U0b2.56(B4)
IO_B15_L15_N: U0b2.47(B13)
IO_B15_L15_P: U0b2.46(B14)
IO_B15_L17_P: R00b2.1
IO_B15_L18_N: U0b2.45(B15)
IO_B15_L18_P: U0b2.44(SELIQ)
NetC00b2_1: C00b2.1 U0b2.37(CLKN)
NetC12b2_2: C12b2.2 U0b2.16(REFIO)
NetC13b2_2: C13b2.2 C14b2.1 R13b2.1 U1b2.1(-)
NetC14b2_2: C14b2.2 C15b2.2 R14b2.1 U1b2.4(+)
NetC16b2_2: C16b2.2 C17b2.1 R15b2.1 U2b2.1(-)
NetC17b2_2: C17b2.2 C18b2.2 R16b2.1 U2b2.4(+)
NetC23b2_1: C23b2.1 L04b2.1 R19b2.2
NetC24b2_1: C24b2.1 L04b2.2 L05b2.1
NetC26b2_1: C26b2.1 L06b2.1 R20b2.2
NetC27b2_1: C27b2.1 L06b2.2 L07b2.1
NetL00b2_1: L00b2.1 R07b2.1 R08b2.2 U0b2.28(OUTIN)
NetL00b2_2: L00b2.2 R13b2.2
NetL01b2_1: L01b2.1 R08b2.1 R09b2.2 U0b2.29(OUTIP)
NetL01b2_2: L01b2.2 R14b2.2
NetL02b2_1: L02b2.1 R10b2.1 R11b2.2 U0b2.24(OUTQN)
NetL02b2_2: L02b2.2 R15b2.2
NetL03b2_1: L03b2.1 R11b2.1 R12b2.2 U0b2.25(OUTQP)
NetL03b2_2: L03b2.2 R16b2.2
NetR00b2_2: R00b2.2 U0b2.38(CLKP)
NetR01b2_1: R01b2.1 U0b2.18(DACREF)
NetR01b2_2: R01b2.2 U0b2.17(FSADJ)
NetR02b2_1: R02b2.1 R03b2.1 U0b2.39(TORB)
NetR04b2_1: R04b2.1 U0b2.40(PD)
NetR05b2_1: R05b2.1 R06b2.1 U0b2.41(DORI)
NetR17b2_1: R17b2.1 U1b2.3(RG)
NetR17b2_2: R17b2.2 U1b2.2(RG)
NetR18b2_1: R18b2.1 U2b2.3(RG)
NetR18b2_2: R18b2.2 U2b2.2(RG)
NetR19b2_1: R19b2.1 U1b2.7(OUT)
NetR20b2_1: R20b2.1 U2b2.7(OUT)

### Notes on the sheet
- *1206 bead is Laird-Signal Integrity Products HZ1206C202R-10*
- *0603 bead is Wurth 74279266*
- 5 MHz, 5th order Chebychev filter for high impedance load.
- On layer 6 (BTM) the DGND and AGND are connected with a 0603 ferrite bead and a 1 Ω resistor in parallel. This gives a DC short-circuit and a maximum 1 Ω impedance at higher frequencies.
- Title:
- Date:
- Sheet
- of
- Board Version:
- File:
- Drawn By:

### Library data of the parts
C00b2 C01b2 C02b2 C03b2 C04b2 C05b2 C06b2 C07b2 C08b2 C09b2 C10b2 C11b2 C12b2 C13b2 C14b2 C15b2 C16b2 C17b2 C18b2 C19b2 C20b2 C21b2 C22b2 C23b2 C24b2 C25b2 C26b2 C27b2 C28b2 C29b2 C30b2 C31b2 C32b2 C33b2 C34b2 C35b2 C36b2 = CAP
L00b2 L01b2 L02b2 L03b2 L04b2 L05b2 L06b2 L07b2 L08b2 L09b2 L10b2 L11b2 L12b2 L13b2 L14b2 L15b2 L16b2 L17b2 = INDUCTOR
R00b2 R01b2 R02b2 R03b2 R04b2 R05b2 R06b2 R07b2 R08b2 R09b2 R10b2 R11b2 R12b2 R13b2 R14b2 R15b2 R16b2 R17b2 R18b2 R19b2 R20b2 R21b2 = RES

## Sheet MAX5875_3.SchDoc
size A; SheetNumber: 16; SheetTotal: 24
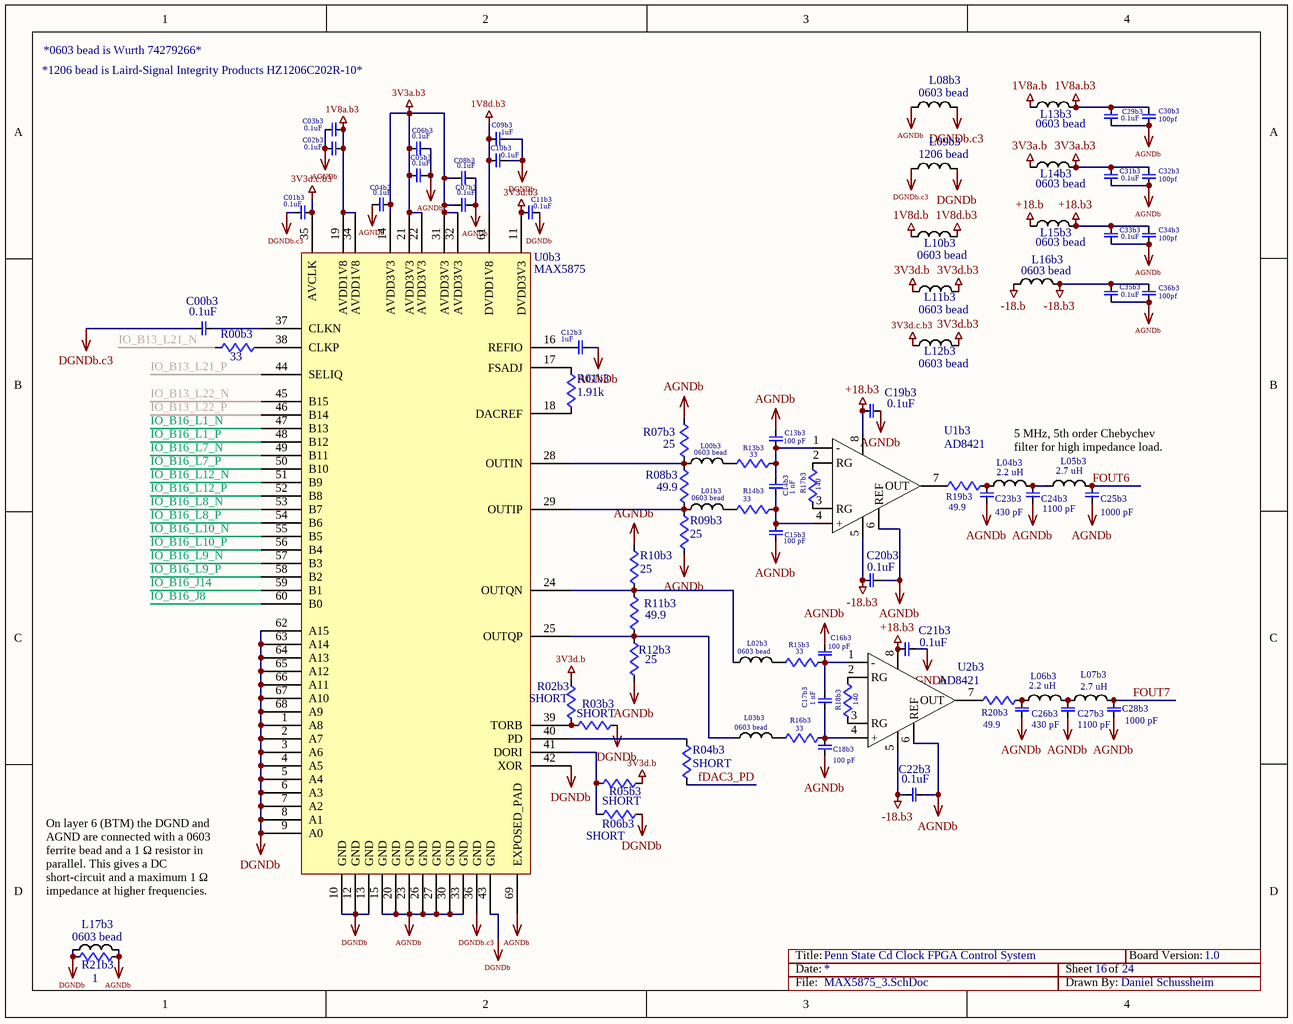
[diagram p5: MAX5875_3.SchDoc]

### Parts
C00b3  0.1uF  [0402]
C01b3  0.1uF  [0402]
C02b3  0.1uF  [0402]
C03b3  0.1uF  [0402]
C04b3  0.1uF  [0402]
C05b3  0.1uF  [0402]
C06b3  0.1uF  [0402]
C07b3  0.1uF  [0402]
C08b3  0.1uF  [0402]
C09b3  1uF  [0603]
C10b3  0.1uF  [0402]
C11b3  0.1uF  [0402]
C12b3  1uF  [0402]
C13b3  100 pF  [0603]
C14b3  1 nF  [0603]
C15b3  100 pF  [0603]
C16b3  100 pF  [0603]
C17b3  1 nF  [0603]
C18b3  100 pF  [0603]
C19b3  0.1uF  [0603]
C20b3  0.1uF  [0603]
C21b3  0.1uF  [0603]
C22b3  0.1uF  [0603]
C23b3  430 pF  [0603]
C24b3  1100 pF  [0603]
C25b3  1000 pF  [0603]
C26b3  430 pF  [0603]
C27b3  1100 pF  [0603]
C28b3  1000 pF  [0603]
C29b3  0.1uF  [0603]
C30b3  100pf  [0603]
C31b3  0.1uF  [0603]
C32b3  100pf  [0603]
C33b3  0.1uF  [0603]
C34b3  100pf  [0603]
C35b3  0.1uF  [0603]
C36b3  100pf  [0603]
L00b3  0603 bead  [0603]
L01b3  0603 bead  [0603]
L02b3  0603 bead  [0603]
L03b3  0603 bead  [0603]
L04b3  2.2 uH  [0603]
L05b3  2.7 uH  [0603]
L06b3  2.2 uH  [0603]
L07b3  2.7 uH  [0603]
L08b3  0603 bead  [0603]
L09b3  1206 bead  [1206]
L10b3  0603 bead  [0603]
L11b3  0603 bead  [0603]
L12b3  0603 bead  [0603]
L13b3  0603 bead  [0603]
L14b3  0603 bead  [0603]
L15b3  0603 bead  [0603]
L16b3  0603 bead  [0603]
L17b3  0603 bead  [0603]
R00b3  33  [0402]
R01b3  1.91k  [0603]
R02b3  SHORT  [0603]
R03b3  SHORT  [0603]
R04b3  SHORT  [0603]
R05b3  SHORT  [0603]
R06b3  SHORT  [0603]
R07b3  25  [0603]
R08b3  49.9  [0603]
R09b3  25  [0603]
R10b3  25  [0603]
R11b3  49.9  [0603]
R12b3  25  [0603]
R13b3  33  [0603]
R14b3  33  [0603]
R15b3  33  [0603]
R16b3  33  [0603]
R17b3  140  [0402]
R18b3  140  [0402]
R19b3  49.9  [0603]
R20b3  49.9  [0603]
R21b3  1  [0603]
U0b3  MAX5875  [68LQFN]
U1b3  AD8421  [8SOIC]
U2b3  AD8421  [8SOIC]

### Nets
1V8a.b: L13b3.1
1V8a.b3: C02b3.1 C03b3.2 C29b3.1 C30b3.1 L13b3.2 U0b3.19(AVDD1V8) U0b3.34(AVDD1V8)
1V8d.b: L10b3.1
1V8d.b3: C09b3.2 C10b3.2 L10b3.2 U0b3.61(DVDD1V8)
3V3a.b: L14b3.1
3V3a.b3: C04b3.1 C05b3.2 C06b3.1 C07b3.2 C08b3.1 C31b3.1 C32b3.1 L14b3.2 U0b3.14(AVDD3V3) U0b3.21(AVDD3V3) U0b3.22(AVDD3V3) U0b3.31(AVDD3V3) U0b3.32(AVDD3V3)
3V3d.b: L11b3.1 R02b3.2 R05b3.2
3V3d.b3: C11b3.2 L11b3.2 L12b3.2 U0b3.11(DVDD3V3)
3V3d.c.b3: C01b3.1 L12b3.1 U0b3.35(AVCLK)
+18.b: L15b3.1
+18.b3: C19b3.2 C21b3.2 C33b3.1 C34b3.1 L15b3.2 U1b3.8(+VS) U2b3.8(+VS)
-18.b: L16b3.1
-18.b3: C20b3.2 C22b3.2 C35b3.1 C36b3.1 L16b3.2 U1b3.5(-VS) U2b3.5(-VS)
AGNDb: C00b3.2 C01b3.2 C02b3.2 C03b3.1 C04b3.2 C05b3.1 C06b3.2 C07b3.1 C08b3.2 C09b3.1 C10b3.1 C11b3.1 C12b3.1 C13b3.1 C15b3.1 C16b3.1 C18b3.1 C19b3.1 C20b3.1 C21b3.1 C22b3.1 C23b3.2 C24b3.2 C25b3.2 C26b3.2 C27b3.2 C28b3.2 C29b3.2 C30b3.2 C31b3.2 C32b3.2 C33b3.2 C34b3.2 C35b3.2 C36b3.2 L08b3.1 L08b3.2 L09b3.1 L09b3.2 L17b3.1 L17b3.2 R03b3.2 R06b3.2 R07b3.2 R09b3.1 R10b3.2 R12b3.1 R21b3.1 R21b3.2 U0b3.1(A8) U0b3.2(A7) U0b3.3(A6) U0b3.4(A5) U0b3.5(A4) U0b3.6(A3) U0b3.7(A2) U0b3.8(A1) U0b3.9(A0) U0b3.10(GND) U0b3.12(GND) U0b3.13(GND) U0b3.15(GND) U0b3.20(GND) U0b3.23(GND) U0b3.26(GND) U0b3.27(GND) U0b3.30(GND) U0b3.33(GND) U0b3.36(GND) U0b3.42(XOR) U0b3.43(GND) U0b3.62(A15) U0b3.63(A14) U0b3.64(A13) U0b3.65(A12) U0b3.66(A11) U0b3.67(A10) U0b3.68(A9) U0b3.69(EXPOSED_PAD) U1b3.6(REF) U2b3.6(REF)  [also labelled DGNDb, DGNDb.c3]  [project net AGNDa]
fDAC3_PD: R04b3.2
FOUT6: C25b3.1 L05b3.2
FOUT7: C28b3.1 L07b3.2
IO_B13_L21_N: R00b3.1
IO_B13_L21_P: U0b3.44(SELIQ)
IO_B13_L22_N: U0b3.45(B15)
IO_B13_L22_P: U0b3.46(B14)
IO_B16_J8: U0b3.60(B0)
IO_B16_J14: U0b3.59(B1)
IO_B16_L1_N: U0b3.47(B13)
IO_B16_L1_P: U0b3.48(B12)
IO_B16_L7_N: U0b3.49(B11)
IO_B16_L7_P: U0b3.50(B10)
IO_B16_L8_N: U0b3.53(B7)
IO_B16_L8_P: U0b3.54(B6)
IO_B16_L9_N: U0b3.57(B3)
IO_B16_L9_P: U0b3.58(B2)
IO_B16_L10_N: U0b3.55(B5)
IO_B16_L10_P: U0b3.56(B4)
IO_B16_L12_N: U0b3.51(B9)
IO_B16_L12_P: U0b3.52(B8)
NetC00b3_1: C00b3.1 U0b3.37(CLKN)
NetC12b3_2: C12b3.2 U0b3.16(REFIO)
NetC13b3_2: C13b3.2 C14b3.1 R13b3.1 U1b3.1(-)
NetC14b3_2: C14b3.2 C15b3.2 R14b3.1 U1b3.4(+)
NetC16b3_2: C16b3.2 C17b3.1 R15b3.1 U2b3.1(-)
NetC17b3_2: C17b3.2 C18b3.2 R16b3.1 U2b3.4(+)
NetC23b3_1: C23b3.1 L04b3.1 R19b3.2
NetC24b3_1: C24b3.1 L04b3.2 L05b3.1
NetC26b3_1: C26b3.1 L06b3.1 R20b3.2
NetC27b3_1: C27b3.1 L06b3.2 L07b3.1
NetL00b3_1: L00b3.1 R07b3.1 R08b3.2 U0b3.28(OUTIN)
NetL00b3_2: L00b3.2 R13b3.2
NetL01b3_1: L01b3.1 R08b3.1 R09b3.2 U0b3.29(OUTIP)
NetL01b3_2: L01b3.2 R14b3.2
NetL02b3_1: L02b3.1 R10b3.1 R11b3.2 U0b3.24(OUTQN)
NetL02b3_2: L02b3.2 R15b3.2
NetL03b3_1: L03b3.1 R11b3.1 R12b3.2 U0b3.25(OUTQP)
NetL03b3_2: L03b3.2 R16b3.2
NetR00b3_2: R00b3.2 U0b3.38(CLKP)
NetR01b3_1: R01b3.1 U0b3.18(DACREF)
NetR01b3_2: R01b3.2 U0b3.17(FSADJ)
NetR02b3_1: R02b3.1 R03b3.1 U0b3.39(TORB)
NetR04b3_1: R04b3.1 U0b3.40(PD)
NetR05b3_1: R05b3.1 R06b3.1 U0b3.41(DORI)
NetR17b3_1: R17b3.1 U1b3.3(RG)
NetR17b3_2: R17b3.2 U1b3.2(RG)
NetR18b3_1: R18b3.1 U2b3.3(RG)
NetR18b3_2: R18b3.2 U2b3.2(RG)
NetR19b3_1: R19b3.1 U1b3.7(OUT)
NetR20b3_1: R20b3.1 U2b3.7(OUT)

### Notes on the sheet
- *1206 bead is Laird-Signal Integrity Products HZ1206C202R-10*
- *0603 bead is Wurth 74279266*
- 5 MHz, 5th order Chebychev filter for high impedance load.
- On layer 6 (BTM) the DGND and AGND are connected with a 0603 ferrite bead and a 1 Ω resistor in parallel. This gives a DC short-circuit and a maximum 1 Ω impedance at higher frequencies.
- Title:
- Date:
- Sheet
- of
- Board Version:
- File:
- Drawn By:

### Library data of the parts
C00b3 C01b3 C02b3 C03b3 C04b3 C05b3 C06b3 C07b3 C08b3 C09b3 C10b3 C11b3 C12b3 C13b3 C14b3 C15b3 C16b3 C17b3 C18b3 C19b3 C20b3 C21b3 C22b3 C23b3 C24b3 C25b3 C26b3 C27b3 C28b3 C29b3 C30b3 C31b3 C32b3 C33b3 C34b3 C35b3 C36b3 = CAP
L00b3 L01b3 L02b3 L03b3 L04b3 L05b3 L06b3 L07b3 L08b3 L09b3 L10b3 L11b3 L12b3 L13b3 L14b3 L15b3 L16b3 L17b3 = INDUCTOR
R00b3 R01b3 R02b3 R03b3 R04b3 R05b3 R06b3 R07b3 R08b3 R09b3 R10b3 R11b3 R12b3 R13b3 R14b3 R15b3 R16b3 R17b3 R18b3 R19b3 R20b3 R21b3 = RES

## Sheet MAX5875_4.SchDoc
size A; SheetNumber: 17; SheetTotal: 24
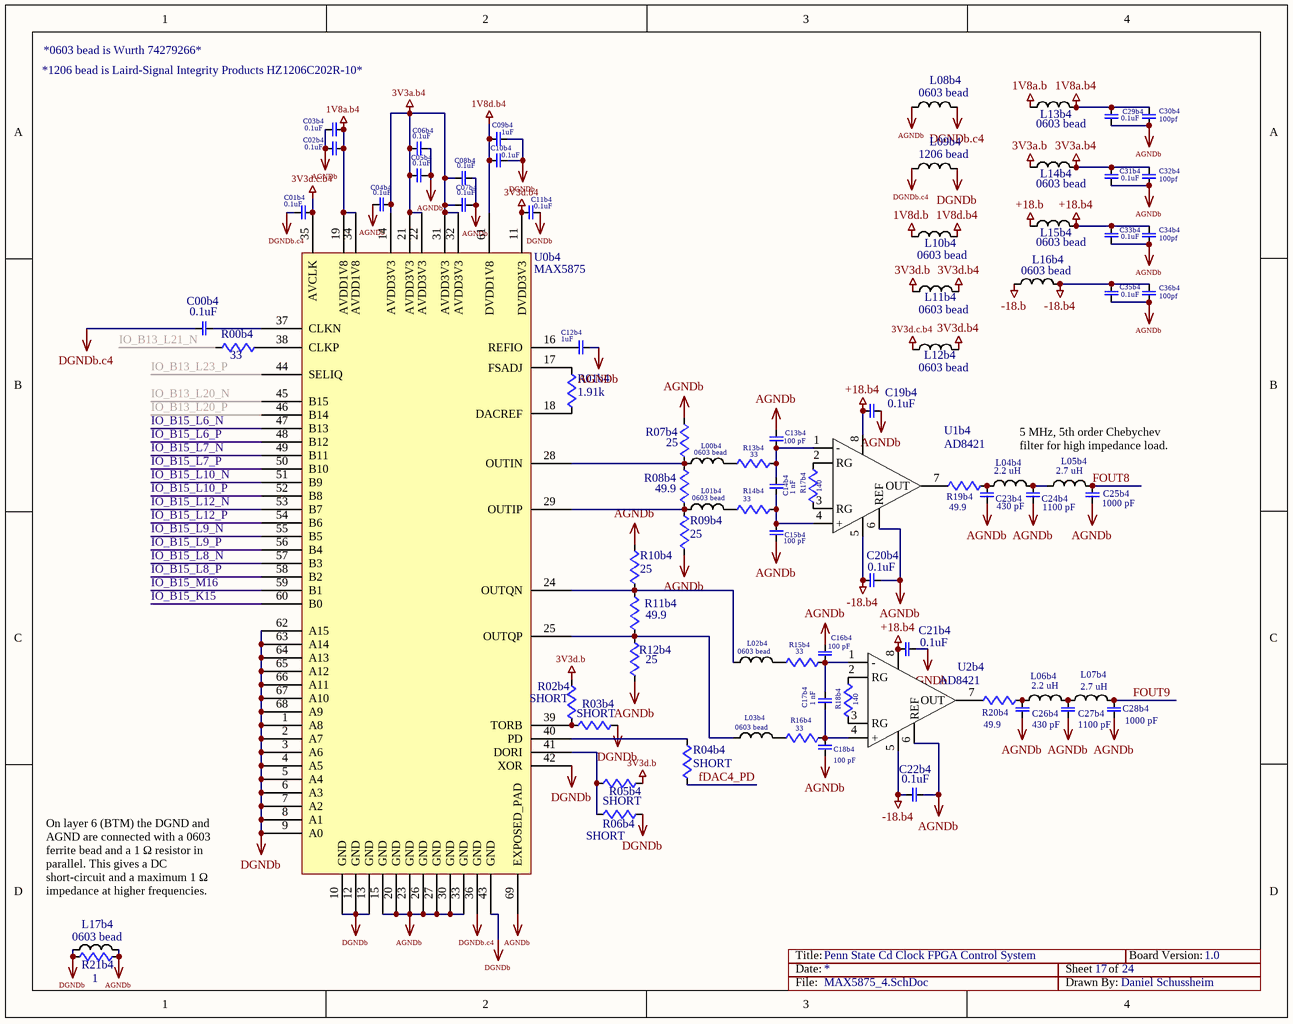
[diagram p6: MAX5875_4.SchDoc]

### Parts
C00b4  0.1uF  [0402]
C01b4  0.1uF  [0402]
C02b4  0.1uF  [0402]
C03b4  0.1uF  [0402]
C04b4  0.1uF  [0402]
C05b4  0.1uF  [0402]
C06b4  0.1uF  [0402]
C07b4  0.1uF  [0402]
C08b4  0.1uF  [0402]
C09b4  1uF  [0603]
C10b4  0.1uF  [0402]
C11b4  0.1uF  [0402]
C12b4  1uF  [0402]
C13b4  100 pF  [0603]
C14b4  1 nF  [0603]
C15b4  100 pF  [0603]
C16b4  100 pF  [0603]
C17b4  1 nF  [0603]
C18b4  100 pF  [0603]
C19b4  0.1uF  [0603]
C20b4  0.1uF  [0603]
C21b4  0.1uF  [0603]
C22b4  0.1uF  [0603]
C23b4  430 pF  [0603]
C24b4  1100 pF  [0603]
C25b4  1000 pF  [0603]
C26b4  430 pF  [0603]
C27b4  1100 pF  [0603]
C28b4  1000 pF  [0603]
C29b4  0.1uF  [0603]
C30b4  100pf  [0603]
C31b4  0.1uF  [0603]
C32b4  100pf  [0603]
C33b4  0.1uF  [0603]
C34b4  100pf  [0603]
C35b4  0.1uF  [0603]
C36b4  100pf  [0603]
L00b4  0603 bead  [0603]
L01b4  0603 bead  [0603]
L02b4  0603 bead  [0603]
L03b4  0603 bead  [0603]
L04b4  2.2 uH  [0603]
L05b4  2.7 uH  [0603]
L06b4  2.2 uH  [0603]
L07b4  2.7 uH  [0603]
L08b4  0603 bead  [0603]
L09b4  1206 bead  [1206]
L10b4  0603 bead  [0603]
L11b4  0603 bead  [0603]
L12b4  0603 bead  [0603]
L13b4  0603 bead  [0603]
L14b4  0603 bead  [0603]
L15b4  0603 bead  [0603]
L16b4  0603 bead  [0603]
L17b4  0603 bead  [0603]
R00b4  33  [0402]
R01b4  1.91k  [0603]
R02b4  SHORT  [0603]
R03b4  SHORT  [0603]
R04b4  SHORT  [0603]
R05b4  SHORT  [0603]
R06b4  SHORT  [0603]
R07b4  25  [0603]
R08b4  49.9  [0603]
R09b4  25  [0603]
R10b4  25  [0603]
R11b4  49.9  [0603]
R12b4  25  [0603]
R13b4  33  [0603]
R14b4  33  [0603]
R15b4  33  [0603]
R16b4  33  [0603]
R17b4  140  [0402]
R18b4  140  [0402]
R19b4  49.9  [0603]
R20b4  49.9  [0603]
R21b4  1  [0603]
U0b4  MAX5875  [68LQFN]
U1b4  AD8421  [8SOIC]
U2b4  AD8421  [8SOIC]

### Nets
1V8a.b: L13b4.1
1V8a.b4: C02b4.1 C03b4.2 C29b4.1 C30b4.1 L13b4.2 U0b4.19(AVDD1V8) U0b4.34(AVDD1V8)
1V8d.b: L10b4.1
1V8d.b4: C09b4.2 C10b4.2 L10b4.2 U0b4.61(DVDD1V8)
3V3a.b: L14b4.1
3V3a.b4: C04b4.1 C05b4.2 C06b4.1 C07b4.2 C08b4.1 C31b4.1 C32b4.1 L14b4.2 U0b4.14(AVDD3V3) U0b4.21(AVDD3V3) U0b4.22(AVDD3V3) U0b4.31(AVDD3V3) U0b4.32(AVDD3V3)
3V3d.b: L11b4.1 R02b4.2 R05b4.2
3V3d.b4: C11b4.2 L11b4.2 L12b4.2 U0b4.11(DVDD3V3)
3V3d.c.b4: C01b4.1 L12b4.1 U0b4.35(AVCLK)
+18.b: L15b4.1
+18.b4: C19b4.2 C21b4.2 C33b4.1 C34b4.1 L15b4.2 U1b4.8(+VS) U2b4.8(+VS)
-18.b: L16b4.1
-18.b4: C20b4.2 C22b4.2 C35b4.1 C36b4.1 L16b4.2 U1b4.5(-VS) U2b4.5(-VS)
AGNDb: C00b4.2 C01b4.2 C02b4.2 C03b4.1 C04b4.2 C05b4.1 C06b4.2 C07b4.1 C08b4.2 C09b4.1 C10b4.1 C11b4.1 C12b4.1 C13b4.1 C15b4.1 C16b4.1 C18b4.1 C19b4.1 C20b4.1 C21b4.1 C22b4.1 C23b4.2 C24b4.2 C25b4.2 C26b4.2 C27b4.2 C28b4.2 C29b4.2 C30b4.2 C31b4.2 C32b4.2 C33b4.2 C34b4.2 C35b4.2 C36b4.2 L08b4.1 L08b4.2 L09b4.1 L09b4.2 L17b4.1 L17b4.2 R03b4.2 R06b4.2 R07b4.2 R09b4.1 R10b4.2 R12b4.1 R21b4.1 R21b4.2 U0b4.1(A8) U0b4.2(A7) U0b4.3(A6) U0b4.4(A5) U0b4.5(A4) U0b4.6(A3) U0b4.7(A2) U0b4.8(A1) U0b4.9(A0) U0b4.10(GND) U0b4.12(GND) U0b4.13(GND) U0b4.15(GND) U0b4.20(GND) U0b4.23(GND) U0b4.26(GND) U0b4.27(GND) U0b4.30(GND) U0b4.33(GND) U0b4.36(GND) U0b4.42(XOR) U0b4.43(GND) U0b4.62(A15) U0b4.63(A14) U0b4.64(A13) U0b4.65(A12) U0b4.66(A11) U0b4.67(A10) U0b4.68(A9) U0b4.69(EXPOSED_PAD) U1b4.6(REF) U2b4.6(REF)  [also labelled DGNDb, DGNDb.c4]  [project net AGNDa]
fDAC4_PD: R04b4.2
FOUT8: C25b4.1 L05b4.2
FOUT9: C28b4.1 L07b4.2
IO_B13_L20_N: U0b4.45(B15)
IO_B13_L20_P: U0b4.46(B14)
IO_B13_L21_N: R00b4.1
IO_B13_L23_P: U0b4.44(SELIQ)
IO_B15_K15: U0b4.60(B0)
IO_B15_L6_N: U0b4.47(B13)
IO_B15_L6_P: U0b4.48(B12)
IO_B15_L7_N: U0b4.49(B11)
IO_B15_L7_P: U0b4.50(B10)
IO_B15_L8_N: U0b4.57(B3)
IO_B15_L8_P: U0b4.58(B2)
IO_B15_L9_N: U0b4.55(B5)
IO_B15_L9_P: U0b4.56(B4)
IO_B15_L10_N: U0b4.51(B9)
IO_B15_L10_P: U0b4.52(B8)
IO_B15_L12_N: U0b4.53(B7)
IO_B15_L12_P: U0b4.54(B6)
IO_B15_M16: U0b4.59(B1)
NetC00b4_1: C00b4.1 U0b4.37(CLKN)
NetC12b4_2: C12b4.2 U0b4.16(REFIO)
NetC13b4_2: C13b4.2 C14b4.1 R13b4.1 U1b4.1(-)
NetC14b4_2: C14b4.2 C15b4.2 R14b4.1 U1b4.4(+)
NetC16b4_2: C16b4.2 C17b4.1 R15b4.1 U2b4.1(-)
NetC17b4_2: C17b4.2 C18b4.2 R16b4.1 U2b4.4(+)
NetC23b4_1: C23b4.1 L04b4.1 R19b4.2
NetC24b4_1: C24b4.1 L04b4.2 L05b4.1
NetC26b4_1: C26b4.1 L06b4.1 R20b4.2
NetC27b4_1: C27b4.1 L06b4.2 L07b4.1
NetL00b4_1: L00b4.1 R07b4.1 R08b4.2 U0b4.28(OUTIN)
NetL00b4_2: L00b4.2 R13b4.2
NetL01b4_1: L01b4.1 R08b4.1 R09b4.2 U0b4.29(OUTIP)
NetL01b4_2: L01b4.2 R14b4.2
NetL02b4_1: L02b4.1 R10b4.1 R11b4.2 U0b4.24(OUTQN)
NetL02b4_2: L02b4.2 R15b4.2
NetL03b4_1: L03b4.1 R11b4.1 R12b4.2 U0b4.25(OUTQP)
NetL03b4_2: L03b4.2 R16b4.2
NetR00b4_2: R00b4.2 U0b4.38(CLKP)
NetR01b4_1: R01b4.1 U0b4.18(DACREF)
NetR01b4_2: R01b4.2 U0b4.17(FSADJ)
NetR02b4_1: R02b4.1 R03b4.1 U0b4.39(TORB)
NetR04b4_1: R04b4.1 U0b4.40(PD)
NetR05b4_1: R05b4.1 R06b4.1 U0b4.41(DORI)
NetR17b4_1: R17b4.1 U1b4.3(RG)
NetR17b4_2: R17b4.2 U1b4.2(RG)
NetR18b4_1: R18b4.1 U2b4.3(RG)
NetR18b4_2: R18b4.2 U2b4.2(RG)
NetR19b4_1: R19b4.1 U1b4.7(OUT)
NetR20b4_1: R20b4.1 U2b4.7(OUT)

### Notes on the sheet
- *1206 bead is Laird-Signal Integrity Products HZ1206C202R-10*
- *0603 bead is Wurth 74279266*
- 5 MHz, 5th order Chebychev filter for high impedance load.
- On layer 6 (BTM) the DGND and AGND are connected with a 0603 ferrite bead and a 1 Ω resistor in parallel. This gives a DC short-circuit and a maximum 1 Ω impedance at higher frequencies.
- Title:
- Date:
- Sheet
- of
- Board Version:
- File:
- Drawn By:

### Library data of the parts
C00b4 C01b4 C02b4 C03b4 C04b4 C05b4 C06b4 C07b4 C08b4 C09b4 C10b4 C11b4 C12b4 C13b4 C14b4 C15b4 C16b4 C17b4 C18b4 C19b4 C20b4 C21b4 C22b4 C23b4 C24b4 C25b4 C26b4 C27b4 C28b4 C29b4 C30b4 C31b4 C32b4 C33b4 C34b4 C35b4 C36b4 = CAP
L00b4 L01b4 L02b4 L03b4 L04b4 L05b4 L06b4 L07b4 L08b4 L09b4 L10b4 L11b4 L12b4 L13b4 L14b4 L15b4 L16b4 L17b4 = INDUCTOR
R00b4 R01b4 R02b4 R03b4 R04b4 R05b4 R06b4 R07b4 R08b4 R09b4 R10b4 R11b4 R12b4 R13b4 R14b4 R15b4 R16b4 R17b4 R18b4 R19b4 R20b4 R21b4 = RES

## Sheet MAX5875_5.SchDoc
size A; SheetNumber: 18; SheetTotal: 24
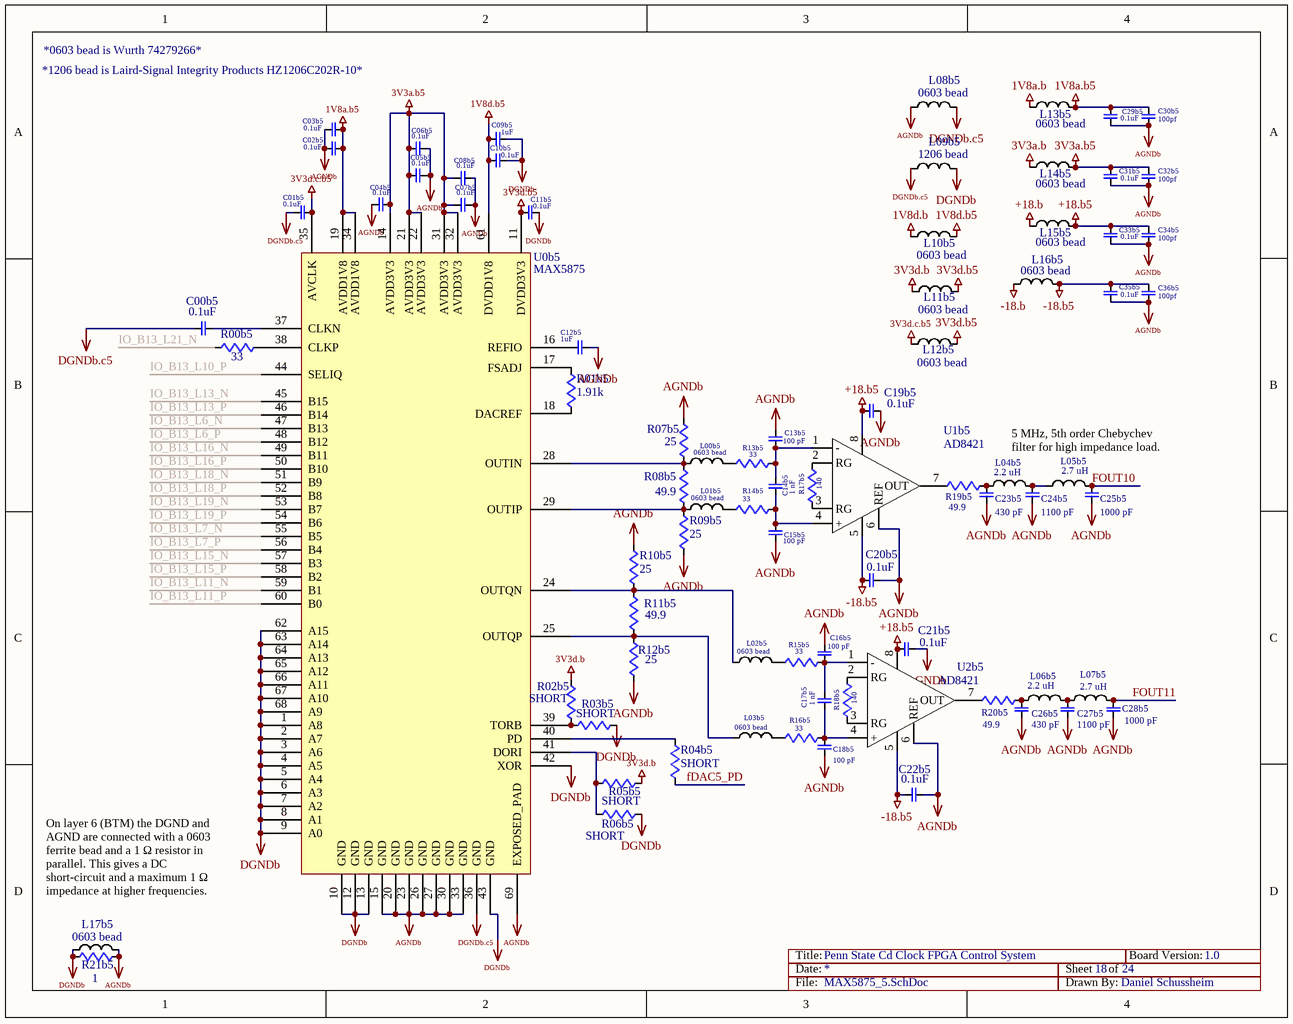
[diagram p7: MAX5875_5.SchDoc]

### Parts
C00b5  0.1uF  [0402]
C01b5  0.1uF  [0402]
C02b5  0.1uF  [0402]
C03b5  0.1uF  [0402]
C04b5  0.1uF  [0402]
C05b5  0.1uF  [0402]
C06b5  0.1uF  [0402]
C07b5  0.1uF  [0402]
C08b5  0.1uF  [0402]
C09b5  1uF  [0603]
C10b5  0.1uF  [0402]
C11b5  0.1uF  [0402]
C12b5  1uF  [0402]
C13b5  100 pF  [0603]
C14b5  1 nF  [0603]
C15b5  100 pF  [0603]
C16b5  100 pF  [0603]
C17b5  1 nF  [0603]
C18b5  100 pF  [0603]
C19b5  0.1uF  [0603]
C20b5  0.1uF  [0603]
C21b5  0.1uF  [0603]
C22b5  0.1uF  [0603]
C23b5  430 pF  [0603]
C24b5  1100 pF  [0603]
C25b5  1000 pF  [0603]
C26b5  430 pF  [0603]
C27b5  1100 pF  [0603]
C28b5  1000 pF  [0603]
C29b5  0.1uF  [0603]
C30b5  100pf  [0603]
C31b5  0.1uF  [0603]
C32b5  100pf  [0603]
C33b5  0.1uF  [0603]
C34b5  100pf  [0603]
C35b5  0.1uF  [0603]
C36b5  100pf  [0603]
L00b5  0603 bead  [0603]
L01b5  0603 bead  [0603]
L02b5  0603 bead  [0603]
L03b5  0603 bead  [0603]
L04b5  2.2 uH  [0603]
L05b5  2.7 uH  [0603]
L06b5  2.2 uH  [0603]
L07b5  2.7 uH  [0603]
L08b5  0603 bead  [0603]
L09b5  1206 bead  [1206]
L10b5  0603 bead  [0603]
L11b5  0603 bead  [0603]
L12b5  0603 bead  [0603]
L13b5  0603 bead  [0603]
L14b5  0603 bead  [0603]
L15b5  0603 bead  [0603]
L16b5  0603 bead  [0603]
L17b5  0603 bead  [0603]
R00b5  33  [0402]
R01b5  1.91k  [0603]
R02b5  SHORT  [0603]
R03b5  SHORT  [0603]
R04b5  SHORT  [0603]
R05b5  SHORT  [0603]
R06b5  SHORT  [0603]
R07b5  25  [0603]
R08b5  49.9  [0603]
R09b5  25  [0603]
R10b5  25  [0603]
R11b5  49.9  [0603]
R12b5  25  [0603]
R13b5  33  [0603]
R14b5  33  [0603]
R15b5  33  [0603]
R16b5  33  [0603]
R17b5  140  [0402]
R18b5  140  [0402]
R19b5  49.9  [0603]
R20b5  49.9  [0603]
R21b5  1  [0603]
U0b5  MAX5875  [68LQFN]
U1b5  AD8421  [8SOIC]
U2b5  AD8421  [8SOIC]

### Nets
1V8a.b: L13b5.1
1V8a.b5: C02b5.1 C03b5.2 C29b5.1 C30b5.1 L13b5.2 U0b5.19(AVDD1V8) U0b5.34(AVDD1V8)
1V8d.b: L10b5.1
1V8d.b5: C09b5.2 C10b5.2 L10b5.2 U0b5.61(DVDD1V8)
3V3a.b: L14b5.1
3V3a.b5: C04b5.1 C05b5.2 C06b5.1 C07b5.2 C08b5.1 C31b5.1 C32b5.1 L14b5.2 U0b5.14(AVDD3V3) U0b5.21(AVDD3V3) U0b5.22(AVDD3V3) U0b5.31(AVDD3V3) U0b5.32(AVDD3V3)
3V3d.b: L11b5.1 R02b5.2 R05b5.2
3V3d.b5: C11b5.2 L11b5.2 L12b5.2 U0b5.11(DVDD3V3)
3V3d.c.b5: C01b5.1 L12b5.1 U0b5.35(AVCLK)
+18.b: L15b5.1
+18.b5: C19b5.2 C21b5.2 C33b5.1 C34b5.1 L15b5.2 U1b5.8(+VS) U2b5.8(+VS)
-18.b: L16b5.1
-18.b5: C20b5.2 C22b5.2 C35b5.1 C36b5.1 L16b5.2 U1b5.5(-VS) U2b5.5(-VS)
AGNDb: C00b5.2 C01b5.2 C02b5.2 C03b5.1 C04b5.2 C05b5.1 C06b5.2 C07b5.1 C08b5.2 C09b5.1 C10b5.1 C11b5.1 C12b5.1 C13b5.1 C15b5.1 C16b5.1 C18b5.1 C19b5.1 C20b5.1 C21b5.1 C22b5.1 C23b5.2 C24b5.2 C25b5.2 C26b5.2 C27b5.2 C28b5.2 C29b5.2 C30b5.2 C31b5.2 C32b5.2 C33b5.2 C34b5.2 C35b5.2 C36b5.2 L08b5.1 L08b5.2 L09b5.1 L09b5.2 L17b5.1 L17b5.2 R03b5.2 R06b5.2 R07b5.2 R09b5.1 R10b5.2 R12b5.1 R21b5.1 R21b5.2 U0b5.1(A8) U0b5.2(A7) U0b5.3(A6) U0b5.4(A5) U0b5.5(A4) U0b5.6(A3) U0b5.7(A2) U0b5.8(A1) U0b5.9(A0) U0b5.10(GND) U0b5.12(GND) U0b5.13(GND) U0b5.15(GND) U0b5.20(GND) U0b5.23(GND) U0b5.26(GND) U0b5.27(GND) U0b5.30(GND) U0b5.33(GND) U0b5.36(GND) U0b5.42(XOR) U0b5.43(GND) U0b5.62(A15) U0b5.63(A14) U0b5.64(A13) U0b5.65(A12) U0b5.66(A11) U0b5.67(A10) U0b5.68(A9) U0b5.69(EXPOSED_PAD) U1b5.6(REF) U2b5.6(REF)  [also labelled DGNDb, DGNDb.c5]  [project net AGNDa]
fDAC5_PD: R04b5.2
FOUT10: C25b5.1 L05b5.2
FOUT11: C28b5.1 L07b5.2
IO_B13_L6_N: U0b5.47(B13)
IO_B13_L6_P: U0b5.48(B12)
IO_B13_L7_N: U0b5.55(B5)
IO_B13_L7_P: U0b5.56(B4)
IO_B13_L10_P: U0b5.44(SELIQ)
IO_B13_L11_N: U0b5.59(B1)
IO_B13_L11_P: U0b5.60(B0)
IO_B13_L13_N: U0b5.45(B15)
IO_B13_L13_P: U0b5.46(B14)
IO_B13_L15_N: U0b5.57(B3)
IO_B13_L15_P: U0b5.58(B2)
IO_B13_L16_N: U0b5.49(B11)
IO_B13_L16_P: U0b5.50(B10)
IO_B13_L18_N: U0b5.51(B9)
IO_B13_L18_P: U0b5.52(B8)
IO_B13_L19_N: U0b5.53(B7)
IO_B13_L19_P: U0b5.54(B6)
IO_B13_L21_N: R00b5.1
NetC00b5_1: C00b5.1 U0b5.37(CLKN)
NetC12b5_2: C12b5.2 U0b5.16(REFIO)
NetC13b5_2: C13b5.2 C14b5.1 R13b5.1 U1b5.1(-)
NetC14b5_2: C14b5.2 C15b5.2 R14b5.1 U1b5.4(+)
NetC16b5_2: C16b5.2 C17b5.1 R15b5.1 U2b5.1(-)
NetC17b5_2: C17b5.2 C18b5.2 R16b5.1 U2b5.4(+)
NetC23b5_1: C23b5.1 L04b5.1 R19b5.2
NetC24b5_1: C24b5.1 L04b5.2 L05b5.1
NetC26b5_1: C26b5.1 L06b5.1 R20b5.2
NetC27b5_1: C27b5.1 L06b5.2 L07b5.1
NetL00b5_1: L00b5.1 R07b5.1 R08b5.2 U0b5.28(OUTIN)
NetL00b5_2: L00b5.2 R13b5.2
NetL01b5_1: L01b5.1 R08b5.1 R09b5.2 U0b5.29(OUTIP)
NetL01b5_2: L01b5.2 R14b5.2
NetL02b5_1: L02b5.1 R10b5.1 R11b5.2 U0b5.24(OUTQN)
NetL02b5_2: L02b5.2 R15b5.2
NetL03b5_1: L03b5.1 R11b5.1 R12b5.2 U0b5.25(OUTQP)
NetL03b5_2: L03b5.2 R16b5.2
NetR00b5_2: R00b5.2 U0b5.38(CLKP)
NetR01b5_1: R01b5.1 U0b5.18(DACREF)
NetR01b5_2: R01b5.2 U0b5.17(FSADJ)
NetR02b5_1: R02b5.1 R03b5.1 U0b5.39(TORB)
NetR04b5_1: R04b5.1 U0b5.40(PD)
NetR05b5_1: R05b5.1 R06b5.1 U0b5.41(DORI)
NetR17b5_1: R17b5.1 U1b5.3(RG)
NetR17b5_2: R17b5.2 U1b5.2(RG)
NetR18b5_1: R18b5.1 U2b5.3(RG)
NetR18b5_2: R18b5.2 U2b5.2(RG)
NetR19b5_1: R19b5.1 U1b5.7(OUT)
NetR20b5_1: R20b5.1 U2b5.7(OUT)

### Notes on the sheet
- *1206 bead is Laird-Signal Integrity Products HZ1206C202R-10*
- *0603 bead is Wurth 74279266*
- 5 MHz, 5th order Chebychev filter for high impedance load.
- On layer 6 (BTM) the DGND and AGND are connected with a 0603 ferrite bead and a 1 Ω resistor in parallel. This gives a DC short-circuit and a maximum 1 Ω impedance at higher frequencies.
- Title:
- Date:
- Sheet
- of
- Board Version:
- File:
- Drawn By:

### Library data of the parts
C00b5 C01b5 C02b5 C03b5 C04b5 C05b5 C06b5 C07b5 C08b5 C09b5 C10b5 C11b5 C12b5 C13b5 C14b5 C15b5 C16b5 C17b5 C18b5 C19b5 C20b5 C21b5 C22b5 C23b5 C24b5 C25b5 C26b5 C27b5 C28b5 C29b5 C30b5 C31b5 C32b5 C33b5 C34b5 C35b5 C36b5 = CAP
L00b5 L01b5 L02b5 L03b5 L04b5 L05b5 L06b5 L07b5 L08b5 L09b5 L10b5 L11b5 L12b5 L13b5 L14b5 L15b5 L16b5 L17b5 = INDUCTOR
R00b5 R01b5 R02b5 R03b5 R04b5 R05b5 R06b5 R07b5 R08b5 R09b5 R10b5 R11b5 R12b5 R13b5 R14b5 R15b5 R16b5 R17b5 R18b5 R19b5 R20b5 R21b5 = RES

## Sheet MAX5875_6.SchDoc
size A; SheetNumber: 19; SheetTotal: 24
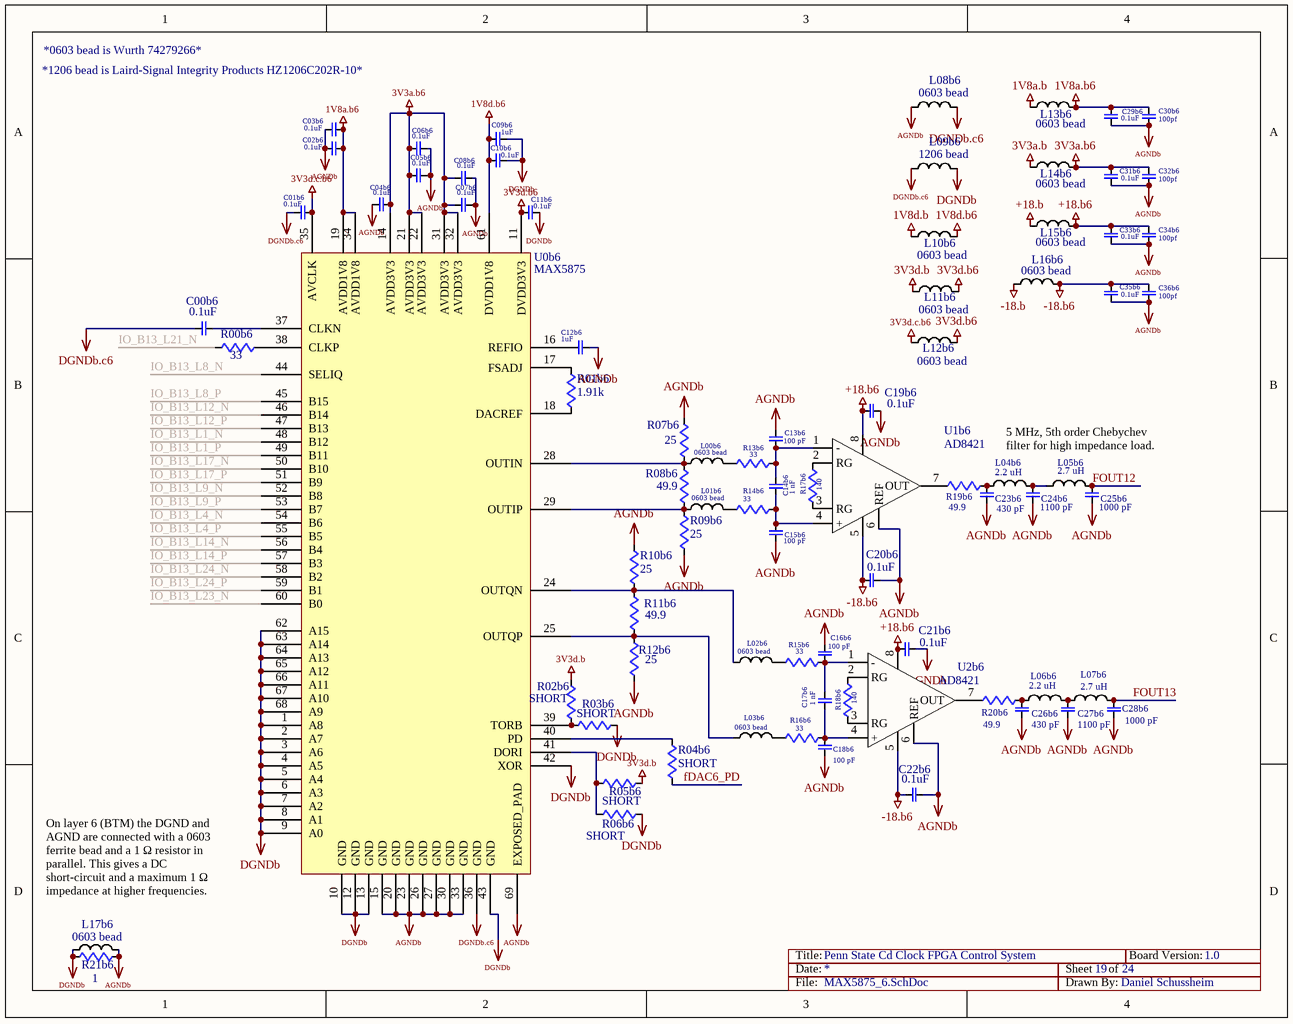
[diagram p8: MAX5875_6.SchDoc]

### Parts
C00b6  0.1uF  [0402]
C01b6  0.1uF  [0402]
C02b6  0.1uF  [0402]
C03b6  0.1uF  [0402]
C04b6  0.1uF  [0402]
C05b6  0.1uF  [0402]
C06b6  0.1uF  [0402]
C07b6  0.1uF  [0402]
C08b6  0.1uF  [0402]
C09b6  1uF  [0603]
C10b6  0.1uF  [0402]
C11b6  0.1uF  [0402]
C12b6  1uF  [0402]
C13b6  100 pF  [0603]
C14b6  1 nF  [0603]
C15b6  100 pF  [0603]
C16b6  100 pF  [0603]
C17b6  1 nF  [0603]
C18b6  100 pF  [0603]
C19b6  0.1uF  [0603]
C20b6  0.1uF  [0603]
C21b6  0.1uF  [0603]
C22b6  0.1uF  [0603]
C23b6  430 pF  [0603]
C24b6  1100 pF  [0603]
C25b6  1000 pF  [0603]
C26b6  430 pF  [0603]
C27b6  1100 pF  [0603]
C28b6  1000 pF  [0603]
C29b6  0.1uF  [0603]
C30b6  100pf  [0603]
C31b6  0.1uF  [0603]
C32b6  100pf  [0603]
C33b6  0.1uF  [0603]
C34b6  100pf  [0603]
C35b6  0.1uF  [0603]
C36b6  100pf  [0603]
L00b6  0603 bead  [0603]
L01b6  0603 bead  [0603]
L02b6  0603 bead  [0603]
L03b6  0603 bead  [0603]
L04b6  2.2 uH  [0603]
L05b6  2.7 uH  [0603]
L06b6  2.2 uH  [0603]
L07b6  2.7 uH  [0603]
L08b6  0603 bead  [0603]
L09b6  1206 bead  [1206]
L10b6  0603 bead  [0603]
L11b6  0603 bead  [0603]
L12b6  0603 bead  [0603]
L13b6  0603 bead  [0603]
L14b6  0603 bead  [0603]
L15b6  0603 bead  [0603]
L16b6  0603 bead  [0603]
L17b6  0603 bead  [0603]
R00b6  33  [0402]
R01b6  1.91k  [0603]
R02b6  SHORT  [0603]
R03b6  SHORT  [0603]
R04b6  SHORT  [0603]
R05b6  SHORT  [0603]
R06b6  SHORT  [0603]
R07b6  25  [0603]
R08b6  49.9  [0603]
R09b6  25  [0603]
R10b6  25  [0603]
R11b6  49.9  [0603]
R12b6  25  [0603]
R13b6  33  [0603]
R14b6  33  [0603]
R15b6  33  [0603]
R16b6  33  [0603]
R17b6  140  [0402]
R18b6  140  [0402]
R19b6  49.9  [0603]
R20b6  49.9  [0603]
R21b6  1  [0603]
U0b6  MAX5875  [68LQFN]
U1b6  AD8421  [8SOIC]
U2b6  AD8421  [8SOIC]

### Nets
1V8a.b: L13b6.1
1V8a.b6: C02b6.1 C03b6.2 C29b6.1 C30b6.1 L13b6.2 U0b6.19(AVDD1V8) U0b6.34(AVDD1V8)
1V8d.b: L10b6.1
1V8d.b6: C09b6.2 C10b6.2 L10b6.2 U0b6.61(DVDD1V8)
3V3a.b: L14b6.1
3V3a.b6: C04b6.1 C05b6.2 C06b6.1 C07b6.2 C08b6.1 C31b6.1 C32b6.1 L14b6.2 U0b6.14(AVDD3V3) U0b6.21(AVDD3V3) U0b6.22(AVDD3V3) U0b6.31(AVDD3V3) U0b6.32(AVDD3V3)
3V3d.b: L11b6.1 R02b6.2 R05b6.2
3V3d.b6: C11b6.2 L11b6.2 L12b6.2 U0b6.11(DVDD3V3)
3V3d.c.b6: C01b6.1 L12b6.1 U0b6.35(AVCLK)
+18.b: L15b6.1
+18.b6: C19b6.2 C21b6.2 C33b6.1 C34b6.1 L15b6.2 U1b6.8(+VS) U2b6.8(+VS)
-18.b: L16b6.1
-18.b6: C20b6.2 C22b6.2 C35b6.1 C36b6.1 L16b6.2 U1b6.5(-VS) U2b6.5(-VS)
AGNDb: C00b6.2 C01b6.2 C02b6.2 C03b6.1 C04b6.2 C05b6.1 C06b6.2 C07b6.1 C08b6.2 C09b6.1 C10b6.1 C11b6.1 C12b6.1 C13b6.1 C15b6.1 C16b6.1 C18b6.1 C19b6.1 C20b6.1 C21b6.1 C22b6.1 C23b6.2 C24b6.2 C25b6.2 C26b6.2 C27b6.2 C28b6.2 C29b6.2 C30b6.2 C31b6.2 C32b6.2 C33b6.2 C34b6.2 C35b6.2 C36b6.2 L08b6.1 L08b6.2 L09b6.1 L09b6.2 L17b6.1 L17b6.2 R03b6.2 R06b6.2 R07b6.2 R09b6.1 R10b6.2 R12b6.1 R21b6.1 R21b6.2 U0b6.1(A8) U0b6.2(A7) U0b6.3(A6) U0b6.4(A5) U0b6.5(A4) U0b6.6(A3) U0b6.7(A2) U0b6.8(A1) U0b6.9(A0) U0b6.10(GND) U0b6.12(GND) U0b6.13(GND) U0b6.15(GND) U0b6.20(GND) U0b6.23(GND) U0b6.26(GND) U0b6.27(GND) U0b6.30(GND) U0b6.33(GND) U0b6.36(GND) U0b6.42(XOR) U0b6.43(GND) U0b6.62(A15) U0b6.63(A14) U0b6.64(A13) U0b6.65(A12) U0b6.66(A11) U0b6.67(A10) U0b6.68(A9) U0b6.69(EXPOSED_PAD) U1b6.6(REF) U2b6.6(REF)  [also labelled DGNDb, DGNDb.c6]  [project net AGNDa]
fDAC6_PD: R04b6.2
FOUT12: C25b6.1 L05b6.2
FOUT13: C28b6.1 L07b6.2
IO_B13_L1_N: U0b6.48(B12)
IO_B13_L1_P: U0b6.49(B11)
IO_B13_L4_N: U0b6.54(B6)
IO_B13_L4_P: U0b6.55(B5)
IO_B13_L8_N: U0b6.44(SELIQ)
IO_B13_L8_P: U0b6.45(B15)
IO_B13_L9_N: U0b6.52(B8)
IO_B13_L9_P: U0b6.53(B7)
IO_B13_L12_N: U0b6.46(B14)
IO_B13_L12_P: U0b6.47(B13)
IO_B13_L14_N: U0b6.56(B4)
IO_B13_L14_P: U0b6.57(B3)
IO_B13_L17_N: U0b6.50(B10)
IO_B13_L17_P: U0b6.51(B9)
IO_B13_L21_N: R00b6.1
IO_B13_L23_N: U0b6.60(B0)
IO_B13_L24_N: U0b6.58(B2)
IO_B13_L24_P: U0b6.59(B1)
NetC00b6_1: C00b6.1 U0b6.37(CLKN)
NetC12b6_2: C12b6.2 U0b6.16(REFIO)
NetC13b6_2: C13b6.2 C14b6.1 R13b6.1 U1b6.1(-)
NetC14b6_2: C14b6.2 C15b6.2 R14b6.1 U1b6.4(+)
NetC16b6_2: C16b6.2 C17b6.1 R15b6.1 U2b6.1(-)
NetC17b6_2: C17b6.2 C18b6.2 R16b6.1 U2b6.4(+)
NetC23b6_1: C23b6.1 L04b6.1 R19b6.2
NetC24b6_1: C24b6.1 L04b6.2 L05b6.1
NetC26b6_1: C26b6.1 L06b6.1 R20b6.2
NetC27b6_1: C27b6.1 L06b6.2 L07b6.1
NetL00b6_1: L00b6.1 R07b6.1 R08b6.2 U0b6.28(OUTIN)
NetL00b6_2: L00b6.2 R13b6.2
NetL01b6_1: L01b6.1 R08b6.1 R09b6.2 U0b6.29(OUTIP)
NetL01b6_2: L01b6.2 R14b6.2
NetL02b6_1: L02b6.1 R10b6.1 R11b6.2 U0b6.24(OUTQN)
NetL02b6_2: L02b6.2 R15b6.2
NetL03b6_1: L03b6.1 R11b6.1 R12b6.2 U0b6.25(OUTQP)
NetL03b6_2: L03b6.2 R16b6.2
NetR00b6_2: R00b6.2 U0b6.38(CLKP)
NetR01b6_1: R01b6.1 U0b6.18(DACREF)
NetR01b6_2: R01b6.2 U0b6.17(FSADJ)
NetR02b6_1: R02b6.1 R03b6.1 U0b6.39(TORB)
NetR04b6_1: R04b6.1 U0b6.40(PD)
NetR05b6_1: R05b6.1 R06b6.1 U0b6.41(DORI)
NetR17b6_1: R17b6.1 U1b6.3(RG)
NetR17b6_2: R17b6.2 U1b6.2(RG)
NetR18b6_1: R18b6.1 U2b6.3(RG)
NetR18b6_2: R18b6.2 U2b6.2(RG)
NetR19b6_1: R19b6.1 U1b6.7(OUT)
NetR20b6_1: R20b6.1 U2b6.7(OUT)

### Notes on the sheet
- *1206 bead is Laird-Signal Integrity Products HZ1206C202R-10*
- *0603 bead is Wurth 74279266*
- 5 MHz, 5th order Chebychev filter for high impedance load.
- On layer 6 (BTM) the DGND and AGND are connected with a 0603 ferrite bead and a 1 Ω resistor in parallel. This gives a DC short-circuit and a maximum 1 Ω impedance at higher frequencies.
- Title:
- Date:
- Sheet
- of
- Board Version:
- File:
- Drawn By:

### Library data of the parts
C00b6 C01b6 C02b6 C03b6 C04b6 C05b6 C06b6 C07b6 C08b6 C09b6 C10b6 C11b6 C12b6 C13b6 C14b6 C15b6 C16b6 C17b6 C18b6 C19b6 C20b6 C21b6 C22b6 C23b6 C24b6 C25b6 C26b6 C27b6 C28b6 C29b6 C30b6 C31b6 C32b6 C33b6 C34b6 C35b6 C36b6 = CAP
L00b6 L01b6 L02b6 L03b6 L04b6 L05b6 L06b6 L07b6 L08b6 L09b6 L10b6 L11b6 L12b6 L13b6 L14b6 L15b6 L16b6 L17b6 = INDUCTOR
R00b6 R01b6 R02b6 R03b6 R04b6 R05b6 R06b6 R07b6 R08b6 R09b6 R10b6 R11b6 R12b6 R13b6 R14b6 R15b6 R16b6 R17b6 R18b6 R19b6 R20b6 R21b6 = RES